# EAGLE design Artemis Charger Mod PCB.1 (EAGLE 7.5.0)
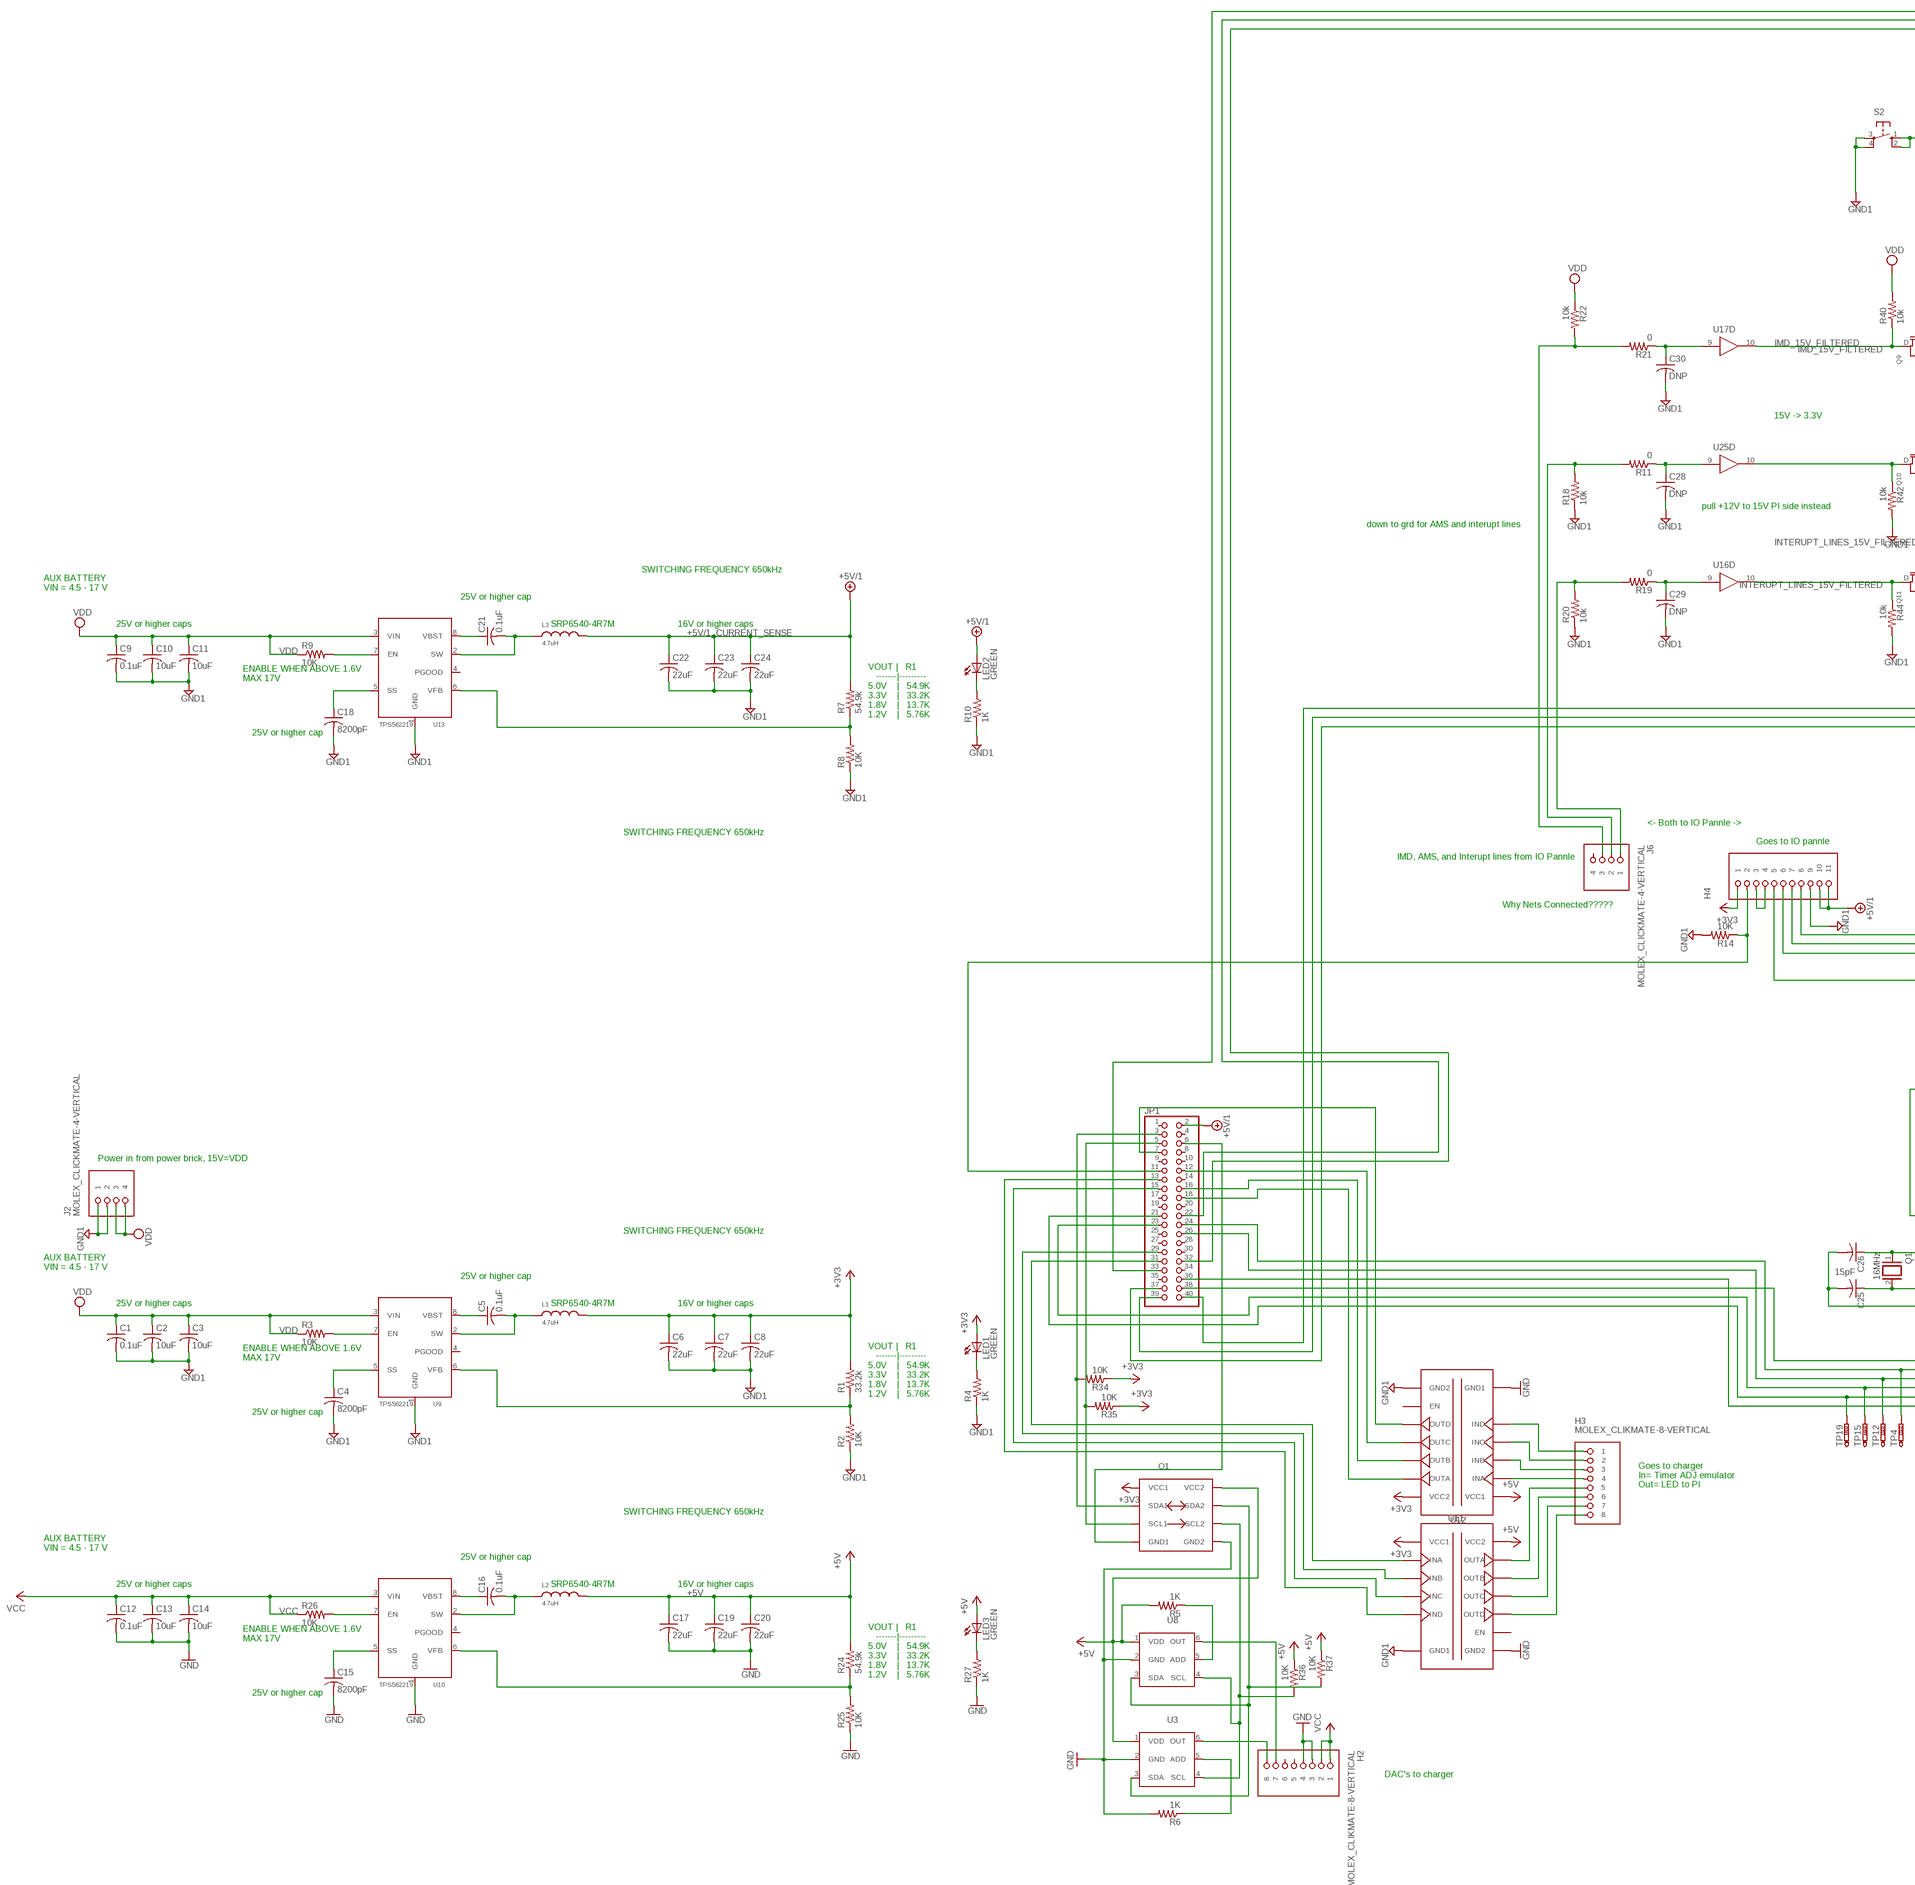
[diagram p0: schematic, sheet 1, part 1 of 2]
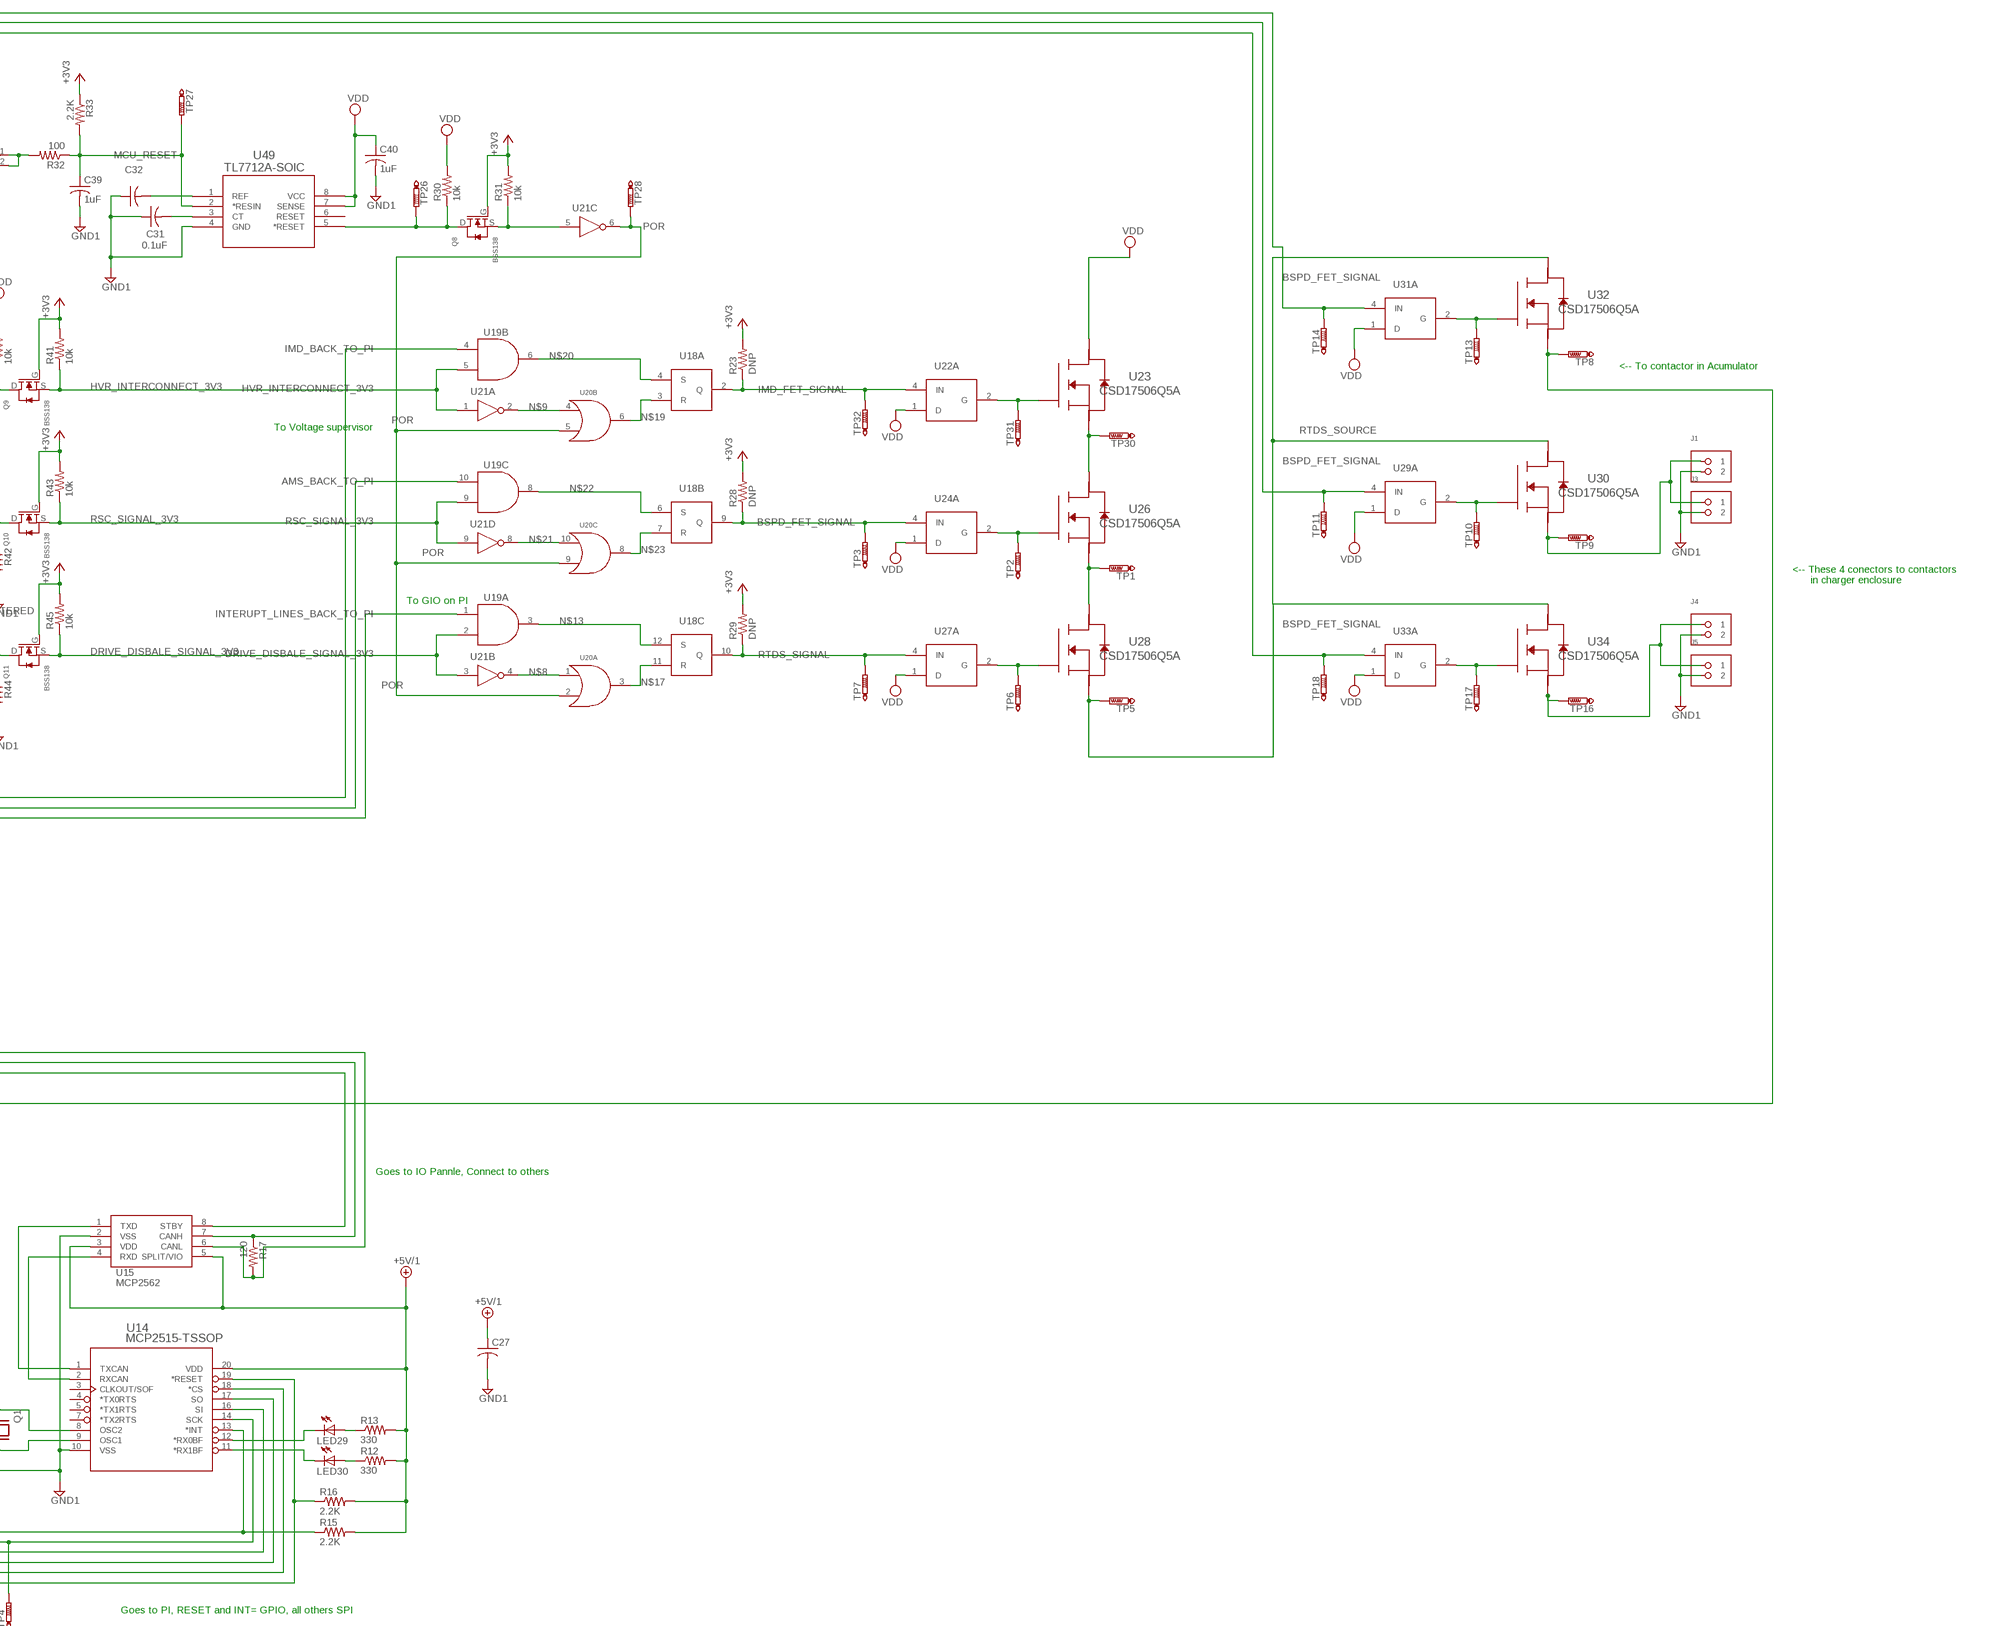
[diagram p1: schematic, sheet 1, part 2 of 2]

## Parts
C1  0.1uF  C-USC0805  [C0805]
C2  10uF  C-USC0805  [C0805]
C3  10uF  C-USC0805  [C0805]
C4  8200pF  C-USC0805  [C0805]
C5  0.1uF  C-USC0805  [C0805]
C6  22uF  C-USC0805  [C0805]
C7  22uF  C-USC0805  [C0805]
C8  22uF  C-USC0805  [C0805]
C9  0.1uF  C-USC0805  [C0805]
C10  10uF  C-USC0805  [C0805]
C11  10uF  C-USC0805  [C0805]
C12  0.1uF  C-USC0805  [C0805]
C13  10uF  C-USC0805  [C0805]
C14  10uF  C-USC0805  [C0805]
C15  8200pF  C-USC0805  [C0805]
C16  0.1uF  C-USC0805  [C0805]
C17  22uF  C-USC0805  [C0805]
C18  8200pF  C-USC0805  [C0805]
C19  22uF  C-USC0805  [C0805]
C20  22uF  C-USC0805  [C0805]
C21  0.1uF  C-USC0805  [C0805]
C22  22uF  C-USC0805  [C0805]
C23  22uF  C-USC0805  [C0805]
C24  22uF  C-USC0805  [C0805]
C25  15pF  C-USC0805  [C0805]
C26  15pF  C-USC0805  [C0805]
C27  0.1uF  C-USC0805  [C0805]
C28  DNP  C-USC0805  [C0805]
C29  DNP  C-USC0805  [C0805]
C30  DNP  C-USC0805  [C0805]
C31  0.1uF  C-USC0805  [C0805]
C32  0.1uF  C-USC0805  [C0805]
C39  1uF  C-USC0805  [C0805]
C40  1uF  C-USC0805  [C0805]
H2  MOLEX_CLIKMATE-8-VERTICAL  [MOLEX-CLIKMATE-8-VERTICAL-HEADER]
H3  MOLEX_CLIKMATE-8-VERTICAL  [MOLEX-CLIKMATE-8-VERTICAL-HEADER]
H4  MOLEX_CLICKMATE-11-VERTICAL-VERTICAL  [MOLEX_CLICKMATE-11-VERTICAL-HEADER]
J1  MOLEX_CLICKMATE-2-VERTICAL  [MOLEX-CLIKMATE-2-VERTICAL-HEADER]
J2  MOLEX_CLICKMATE-4-VERTICAL  [MOLEX-CLIKMATE-4-VERTICAL-HEADER]
J3  MOLEX_CLICKMATE-2-VERTICAL  [MOLEX-CLIKMATE-2-VERTICAL-HEADER]
J4  MOLEX_CLICKMATE-2-VERTICAL  [MOLEX-CLIKMATE-2-VERTICAL-HEADER]
J5  MOLEX_CLICKMATE-2-VERTICAL  [MOLEX-CLIKMATE-2-VERTICAL-HEADER]
J6  MOLEX_CLICKMATE-4-VERTICAL  [MOLEX-CLIKMATE-4-VERTICAL-HEADER]
JP1  PINHD-2X20  [2X20]
L1  4.7uH  SRP6540  [SRP6540]
L2  4.7uH  SRP6540  [SRP6540]
L3  4.7uH  SRP6540  [SRP6540]
LED1  GREEN  LEDCHIPLED_0805  [CHIPLED_0805]
LED2  GREEN  LEDCHIPLED_0805  [CHIPLED_0805]
LED3  GREEN  LEDCHIPLED_0805  [CHIPLED_0805]
LED29  LEDCHIP-LED0805  [CHIP-LED0805]
LED30  LEDCHIP-LED0805  [CHIP-LED0805]
O1  ISO1541  [ISO1541]
Q1  16MHz  XTAL/S  [QS]
Q8  BSS138  [BSS138]
Q9  BSS138  [BSS138]
Q10  BSS138  [BSS138]
Q11  BSS138  [BSS138]
R1  33.2k  R-US_R0805  [R0805]
R2  10K  R-US_R0805  [R0805]
R3  10K  R-US_R0805  [R0805]
R4  1K  R-US_R0805  [R0805]
R5  1K  R-US_R0805  [R0805]
R6  1K  R-US_R0805  [R0805]
R7  54.9k  R-US_R0805  [R0805]
R8  10K  R-US_R0805  [R0805]
R9  10K  R-US_R0805  [R0805]
R10  1K  R-US_R0805  [R0805]
R11  0  R-US_R0805  [R0805]
R12  330  R-US_R0805  [R0805]
R13  330  R-US_R0805  [R0805]
R14  10K  R-US_R0805  [R0805]
R15  2.2K  R-US_R0805  [R0805]
R16  2.2K  R-US_R0805  [R0805]
R17  120  R-US_R0805  [R0805]
R18  10k  R-US_R0805  [R0805]
R19  0  R-US_R0805  [R0805]
R20  10k  R-US_R0805  [R0805]
R21  0  R-US_R0805  [R0805]
R22  10k  R-US_R0805  [R0805]
R23  DNP  R-US_R0805  [R0805]
R24  54.9k  R-US_R0805  [R0805]
R25  10K  R-US_R0805  [R0805]
R26  10K  R-US_R0805  [R0805]
R27  1K  R-US_R0805  [R0805]
R28  DNP  R-US_R0805  [R0805]
R29  DNP  R-US_R0805  [R0805]
R30  10k  R-US_R0805  [R0805]
R31  10k  R-US_R0805  [R0805]
R32  100  R-US_R0805  [R0805]
R33  2.2K  R-US_R0805  [R0805]
R34  10K  R-US_R0805  [R0805]
R35  10K  R-US_R0805  [R0805]
R36  10K  R-US_R0805  [R0805]
R37  10K  R-US_R0805  [R0805]
R40  10k  R-US_R0805  [R0805]
R41  10k  R-US_R0805  [R0805]
R42  10k  R-US_R0805  [R0805]
R43  10k  R-US_R0805  [R0805]
R44  10k  R-US_R0805  [R0805]
R45  10k  R-US_R0805  [R0805]
S2  10-XX  [B3F-10XX]
TP1  PTR1TP20R  [TP20R]
TP2  PTR1TP20R  [TP20R]
TP3  PTR1TP20R  [TP20R]
TP4  PTR1TP20R  [TP20R]
TP5  PTR1TP20R  [TP20R]
TP6  PTR1TP20R  [TP20R]
TP7  PTR1TP20R  [TP20R]
TP8  PTR1TP20R  [TP20R]
TP9  PTR1TP20R  [TP20R]
TP10  PTR1TP20R  [TP20R]
TP11  PTR1TP20R  [TP20R]
TP12  PTR1TP20R  [TP20R]
TP13  PTR1TP20R  [TP20R]
TP14  PTR1TP20R  [TP20R]
TP15  PTR1TP20R  [TP20R]
TP16  PTR1TP20R  [TP20R]
TP17  PTR1TP20R  [TP20R]
TP18  PTR1TP20R  [TP20R]
TP19  PTR1TP20R  [TP20R]
TP26  PTR1TP20R  [TP20R]
TP27  PTR1TP20R  [TP20R]
TP28  PTR1TP20R  [TP20R]
TP30  PTR1TP20R  [TP20R]
TP31  PTR1TP20R  [TP20R]
TP32  PTR1TP20R  [TP20R]
U3  MAX5812  MAX5812M  [MAX5812]
U8  MAX5812  MAX5812M  [MAX5812]
U9  TPS562219  [TPS562219]
U10  TPS562219  [TPS562219]
U11  ISO7340  [ISO734X]
U12  ISO7340  [ISO734X]
U13  TPS562219  [TPS562219]
U14  MCP2515-TSSOP  [TSSOP20_MC]
U15  MCP2562  MCP256X-SOIC  [SOIC8-N_MC]
U16  CD4050BD  [SOIC-16]
U17  CD4050BD  [SOIC-16]
U18  CD4043B  [PW16-M]
U19  SN74LVC08ASOIC  [D14]
U20  SN74LVC32ASOIC  [D14]
U21  SN74LVC04ASOIC  [SOIC-14]
U22  LTC1155  [LT-SOL8]
U23  CSD17506Q5A  [SON_5X6]
U24  LTC1155  [LT-SOL8]
U25  CD4050BD  [SOIC-16]
U26  CSD17506Q5A  [SON_5X6]
U27  LTC1155  [LT-SOL8]
U28  CSD17506Q5A  [SON_5X6]
U29  LTC1155  [LT-SOL8]
U30  CSD17506Q5A  [SON_5X6]
U31  LTC1155  [LT-SOL8]
U32  CSD17506Q5A  [SON_5X6]
U33  LTC1155  [LT-SOL8]
U34  CSD17506Q5A  [SON_5X6]
U49  TL7712A-SOIC  TL7709A-SOIC  [D8]

## Nets
+3V3: H4.1 Q8.G Q9.G Q10.G Q11.G R23.2 R28.2 R29.2 R31.2 R33.1 R34.1 R35.1 R41.2 R43.2 R45.2
+3V3_CURRENT_SENSE: C6.1 C7.1 C8.1 L1.P$2 R1.2 ; supply symbol labelled +3V3
+5V: C17.1 C19.1 C20.1 L2.P$2 LED3.A O1.8(VCC2) R5.2 R24.2 R36.1 R37.1 U3.1(VDD) U8.1(VDD) U11.P$16(VCC2) U12.P$1(VCC1)
+5V/1_CURRENT_SENSE: C22.1 C23.1 C24.1 C27.1 H4.10 H4.11 JP1.2 L3.P$2 LED1.A LED2.A O1.1(VCC1) R7.2 R12.2 R13.2 R15.2 R16.2 U11.P$1(VCC1) U12.P$16(VCC2) U14.20(VDD) U15.3(VDD) U15.5(SPLIT/VIO) ; supply symbol labelled +3V3, +5V/1
AMS15V: J6.2 R11.2 R18.2
AMS_15V_FILTERED: Q10.D R42.1 U25.10(D:OUT)
AMS_BACK_TO_PI: JP1.39 U19.10(C:IN1)
BSPD_FET_SIGNAL: JP1.22 JP1.32 JP1.33 R28.1 TP3.TP TP11.TP TP14.TP TP18.TP U18.9(B:Q) U24.4(A:IN) U29.4(A:IN) U31.4(A:IN) U33.4(A:IN)
CAN_HIGH: H4.7 R17.1 U15.7(CANH)
DRIVE_DISBALE_SIGNAL_3V3: Q11.S R45.1 U19.2(A:IN2) U21.3(B:IN)
GND: C12.2 C13.2 C14.2 C15.2 C17.2 C19.2 C20.2 H2.3 H2.4 O1.5(GND2) R6.2 R25.1 R27.1 U3.2(GND) U8.2(GND) U10.1(GND) U11.P$9(GND2) U11.P$15(GND2) U12.P$2(GND1) U12.P$8(GND1)
GND1: C1.2 C2.2 C3.2 C4.2 C6.2 C7.2 C8.2 C9.2 C10.2 C11.2 C18.2 C22.2 C23.2 C24.2 C25.2 C26.2 C27.2 C28.2 C29.2 C30.2 C31.1 C32.1 C39.2 C40.2 H4.9 J1.2 J2.1 J2.2 J3.2 J4.2 J5.2 R2.1 R4.1 R8.1 R10.1 R14.2 R18.1 R20.1 R42.2 R44.2 S2.3(P) S2.4(P1) U9.1(GND) U11.P$2(GND1) U11.P$8(GND1) U12.P$9(GND2) U12.P$15(GND2) U13.1(GND) U14.10(VSS) U15.2(VSS) U49.4(GND)
HVR_INTERCONNECT_3V3: Q9.S R41.1 U19.5(B:IN2) U21.1(A:IN)
IMD15V: J6.3 R21.2 R22.2
IMD_15V_FILTERED: Q9.D R40.1 U17.10(D:OUT)
IMD_BACK_TO_PI: JP1.40 U19.4(B:IN1)
IMD_FET_SIGNAL: R23.1 TP32.TP U18.2(A:Q) U22.4(A:IN)
INTERUPT15V: J6.1 R19.2 R20.2
INTERUPT_LINES_15V_FILTERED: Q11.D R44.1 U16.10(D:OUT)
INTERUPT_LINES_BACK_TO_PI: JP1.37 U19.1(A:IN1)
MCU_RESET: C39.1 R32.1 R33.2 TP27.TP U49.2(*RESIN)
MI: JP1.26 TP12.TP U14.16(SI)
MO: JP1.23 TP15.TP U14.17(SO)
N$1: R3.2 U9.7(EN)
N$2: LED1.C R4.2
N$4: R5.1 U8.5(ADD)
N$5: JP1.31 U11.P$3(INA)
N$6: J4.1 J5.1 TP16.TP U34.1(S) U34.2(S) U34.3(S)
N$7: O1.7(SDA2) U3.3(SDA) U8.3(SDA)
N$8: O1.6(SCL2) R36.2 U3.4(SCL) U8.4(SCL) U20.1(A:IN1) U21.4(B:OUT)
N$9: JP1.3 O1.2(SDA1) R34.2 U20.4(B:IN1) U21.2(A:OUT)
N$10: JP1.5 O1.3(SCL1) R35.2
N$11: R6.1 U3.5(ADD)
N$13: U18.12(C:S) U19.3(A:OUT)
N$17: U18.11(C:R) U20.3(A:OUT)
N$18: JP1.6 O1.4(GND1)
N$19: U18.3(A:R) U20.6(B:OUT)
N$20: U18.4(A:S) U19.6(B:OUT)
N$21: U20.10(C:IN1) U21.8(D:OUT)
N$22: U18.6(B:S) U19.8(C:OUT)
N$23: R26.2 U10.7(EN) U18.7(B:R) U20.8(C:OUT)
N$24: JP1.29 U11.P$4(INB)
N$25: H2.8 U3.6(OUT)
N$26: H2.7 U8.6(OUT)
N$27: JP1.13 U11.P$6(IND)
N$28: LED3.C R27.2
N$29: JP1.15 U11.P$5(INC)
N$30: H3.5 U11.P$14(OUTA)
N$31: H3.6 U11.P$13(OUTB)
N$32: H3.7 U11.P$12(OUTC)
N$33: H3.8 U11.P$11(OUTD)
N$34: H3.4 U12.P$3(INA)
N$35: H3.3 U12.P$4(INB)
N$36: H3.2 U12.P$5(INC)
N$37: H3.1 U12.P$6(IND)
N$38: JP1.18 U12.P$14(OUTA)
N$39: JP1.16 U12.P$13(OUTB)
N$40: JP1.12 U12.P$12(OUTC)
N$41: JP1.7 U12.P$11(OUTD)
N$42: H4.3 H4.4
N$43: C28.1 R11.1 U25.9(D:IN)
N$44: R9.2 U13.7(EN)
N$45: LED2.C R10.2
N$46: U14.2(RXCAN) U15.4(RXD)
N$47: U14.1(TXCAN) U15.1(TXD)
N$48: H4.6 U15.8(STBY)
N$49: JP1.38 R15.1 U14.13(*INT)
N$50: C29.1 R19.1 U16.9(D:IN)
N$51: H4.8 R17.2 U15.6(CANL)
N$52: H4.2 JP1.11 R14.1
N$53: C30.1 R21.1 U17.9(D:IN)
N$54: TP31.TP U22.2(A:G) U23.4(G)
N$55: TP2.TP U24.2(A:G) U26.4(G)
N$56: TP6.TP U27.2(A:G) U28.4(G)
N$57: TP10.TP U29.2(A:G) U30.4(G)
N$58: Q8.S R31.1 U21.5(C:IN)
N$59: TP13.TP U31.2(A:G) U32.4(G)
N$61: Q8.D R30.1 TP26.TP U49.5(*RESET)
N$62: R32.2 S2.1(S) S2.2(S1)
N$64: TP17.TP U33.2(A:G) U34.4(G)
N$68: JP1.36 R16.1 U14.19(*RESET)
N$70: JP1.21 TP19.TP U14.18(*CS)
N$77: LED30.C U14.11(*RX1BF)
N$80: LED29.C U14.12(*RX0BF)
N$99: LED30.A R12.1
N$100: LED29.A R13.1
N$123: C26.1 Q1.1 U14.8(OSC2)
N$124: C25.1 Q1.2 U14.9(OSC1)
N$189: C31.2 U49.3(CT)
N$190: C32.2 U49.1(REF)
POR: TP28.TP U20.2(A:IN2) U20.5(B:IN2) U20.9(C:IN2) U21.6(C:OUT)
RSC_SIGNAL_3V3: Q10.S R43.1 U19.9(C:IN2) U21.9(D:IN)
RTDS_SIGNAL: R29.1 TP7.TP U18.10(C:Q) U27.4(A:IN)
RTDS_SOURCE: TP1.TP TP5.TP TP30.TP U23.1(S) U23.2(S) U23.3(S) U26.1(S) U26.2(S) U26.3(S) U26.5(D) U26.6(D) U26.7(D) U26.8(D) U26.PAD1(D) U26.PAD(D) U26.VIA1(D) U26.VIA2(D) U26.VIA3(D) U26.VIA4(D) U26.VIA5(D) U26.VIA6(D) U26.VIA7(D) U26.VIA8(D) U26.VIA9(D) U28.1(S) U28.2(S) U28.3(S) U28.5(D) U28.6(D) U28.7(D) U28.8(D) U28.PAD1(D) U28.PAD(D) U28.VIA1(D) U28.VIA2(D) U28.VIA3(D) U28.VIA4(D) U28.VIA5(D) U28.VIA6(D) U28.VIA7(D) U28.VIA8(D) U28.VIA9(D) U30.5(D) U30.6(D) U30.7(D) U30.8(D) U30.PAD1(D) U30.PAD(D) U30.VIA1(D) U30.VIA2(D) U30.VIA3(D) U30.VIA4(D) U30.VIA5(D) U30.VIA6(D) U30.VIA7(D) U30.VIA8(D) U30.VIA9(D) U32.5(D) U32.6(D) U32.7(D) U32.8(D) U32.PAD1(D) U32.PAD(D) U32.VIA1(D) U32.VIA2(D) U32.VIA3(D) U32.VIA4(D) U32.VIA5(D) U32.VIA6(D) U32.VIA7(D) U32.VIA8(D) U32.VIA9(D) U34.5(D) U34.6(D) U34.7(D) U34.8(D) U34.PAD1(D) U34.PAD(D) U34.VIA1(D) U34.VIA2(D) U34.VIA3(D) U34.VIA4(D) U34.VIA5(D) U34.VIA6(D) U34.VIA7(D) U34.VIA8(D) U34.VIA9(D)
RTDS_SOURCE1: J1.1 J3.1 TP9.TP U30.1(S) U30.2(S) U30.3(S)
RTDS_SOURCE2: H4.5 TP8.TP U32.1(S) U32.2(S) U32.3(S)
SCK: JP1.24 TP4.TP U14.14(SCK)
SS_5V: C15.1 U10.5(SS)
SS_5V1: C4.1 U9.5(SS)
SS_5V2: C18.1 U13.5(SS)
SW_5V: C16.2 C21.1 C21.2 L2.P$1 L3.P$1 U10.2(SW) U13.2(SW) U13.8(VBST)
SW_5V1: C5.2 L1.P$1 U9.2(SW)
VBST_5V: C16.1 U10.8(VBST)
VBST_5V1: C5.1 U9.8(VBST)
VCC: C12.1 C13.1 C14.1 H2.1 H2.2 R26.1 U10.3(VIN)
VDD: C1.1 C2.1 C3.1 C9.1 C10.1 C11.1 C40.1 J2.3 J2.4 R3.1 R9.1 R22.1 R30.2 R40.2 U9.3(VIN) U13.3(VIN) U22.1(A:D) U23.5(D) U23.6(D) U23.7(D) U23.8(D) U23.PAD1(D) U23.PAD(D) U23.VIA1(D) U23.VIA2(D) U23.VIA3(D) U23.VIA4(D) U23.VIA5(D) U23.VIA6(D) U23.VIA7(D) U23.VIA8(D) U23.VIA9(D) U24.1(A:D) U27.1(A:D) U29.1(A:D) U31.1(A:D) U33.1(A:D) U49.7(SENSE) U49.8(VCC)
VFB_5V: R24.1 R25.2 U10.6(VFB)
VFB_5V1: R1.1 R2.2 U9.6(VFB)
VFB_5V2: R7.1 R8.2 U13.6(VFB)
Unconnected: H2.5 H2.6 J6.4 JP1.1 JP1.4 JP1.8 JP1.9 JP1.10 JP1.14 JP1.17 JP1.19 JP1.20 JP1.25 JP1.27 JP1.28 JP1.30 JP1.34 JP1.35 R37.2 U9.4(PGOOD) U10.4(PGOOD) U11.P$10(EN) U12.P$10(EN) U13.4(PGOOD) U14.3(CLKOUT/SOF) U14.4(*TX0RTS) U14.5(*TX1RTS) U14.7(*TX2RTS) U16.2(A:OUT) U16.3(A:IN) U16.4(B:OUT) U16.5(B:IN) U16.6(C:OUT) U16.7(C:IN) U16.11(E:IN) U16.12(E:OUT) U16.14(F:IN) U16.15(F:OUT) U17.2(A:OUT) U17.3(A:IN) U17.4(B:OUT) U17.5(B:IN) U17.6(C:OUT) U17.7(C:IN) U17.11(E:IN) U17.12(E:OUT) U17.14(F:IN) U17.15(F:OUT) U18.1(D:Q) U18.5(EN:EN) U18.14(D:S) U18.15(D:R) U19.11(D:OUT) U19.12(D:IN2) U19.13(D:IN1) U20.11(D:OUT) U20.12(D:IN2) U20.13(D:IN1) U21.10(E:OUT) U21.11(E:IN) U21.12(F:OUT) U21.13(F:IN) U22.5(B:IN) U22.7(B:G) U22.8(B:D) U24.5(B:IN) U24.7(B:G) U24.8(B:D) U25.2(A:OUT) U25.3(A:IN) U25.4(B:OUT) U25.5(B:IN) U25.6(C:OUT) U25.7(C:IN) U25.11(E:IN) U25.12(E:OUT) U25.14(F:IN) U25.15(F:OUT) U27.5(B:IN) U27.7(B:G) U27.8(B:D) U29.5(B:IN) U29.7(B:G) U29.8(B:D) U31.5(B:IN) U31.7(B:G) U31.8(B:D) U33.5(B:IN) U33.7(B:G) U33.8(B:D) U49.6(RESET)

## Notes on the sheet
- <-- To contactor in Acumulator
- To Voltage supervisor
- 15V -> 3.3V
- pull +12V to 15V PI side instead
- <-- These 4 conectors to contactors
        in charger enclosure
- down to grd for AMS and interupt lines
- To GIO on PI
- SWITCHING FREQUENCY 650kHz
- AUX BATTERY
  VIN = 4.5 - 17 V
- 25V or higher cap
- 25V or higher caps | SRP6540-4R7M | 16V or higher caps
- ENABLE WHEN ABOVE 1.6V
  MAX 17V
- VOUT |   R1
     -------|---------
  5.0V    |   54.9K
  3.3V    |   33.2K
  1.8V    |   13.7K
  1.2V    |   5.76K
- 25V or higher cap
- SWITCHING FREQUENCY 650kHz | <- Both to IO Pannle ->
- Goes to IO pannle
- IMD, AMS, and Interupt lines from IO Pannle
- Why Nets Connected?????
- Goes to IO Pannle, Connect to others
- Power in from power brick, 15V=VDD
- SWITCHING FREQUENCY 650kHz
- AUX BATTERY
  VIN = 4.5 - 17 V
- 25V or higher cap
- 25V or higher caps | SRP6540-4R7M | 16V or higher caps
- ENABLE WHEN ABOVE 1.6V
  MAX 17V
- VOUT |   R1
     -------|---------
  5.0V    |   54.9K
  3.3V    |   33.2K
  1.8V    |   13.7K
  1.2V    |   5.76K
- 25V or higher cap
- Goes to PI, RESET and INT= GPIO, all others SPI
- Goes to charger
  In= Timer ADJ emulator
- Out= LED to PI
- SWITCHING FREQUENCY 650kHz
- AUX BATTERY
  VIN = 4.5 - 17 V
- 25V or higher cap
- 25V or higher caps | SRP6540-4R7M | 16V or higher caps
- ENABLE WHEN ABOVE 1.6V
  MAX 17V
- VOUT |   R1
     -------|---------
  5.0V    |   54.9K
  3.3V    |   33.2K
  1.8V    |   13.7K
  1.2V    |   5.76K
- 25V or higher cap
- DAC's to charger

## Power pins joined to a net without a drawn wire
GND: U16.8(POWER:GND) U17.8(POWER:GND) U18.8(P:GND) U19.7(P:GND) U20.7(P:GND) U21.7(POWER:GND) U22.3(P:GND) U24.3(P:GND) U25.8(POWER:GND) U27.3(P:GND) U29.3(P:GND) U31.3(P:GND) U33.3(P:GND)
VCC: U16.1(POWER:VCC) U17.1(POWER:VCC) U18.16(P:VCC) U19.14(P:VCC) U20.14(P:VCC) U21.14(POWER:VCC) U22.6(P:VCC) U24.6(P:VCC) U25.1(POWER:VCC) U27.6(P:VCC) U29.6(P:VCC) U31.6(P:VCC) U33.6(P:VCC)

## Library data of the parts
C1 C5 C9 C12 C16 C21 = adafruit:C-US: CAPACITOR, American symbol; PARTNO: GRM21BR71E104KA01L
C2 C3 C10 C11 C13 C14 = adafruit:C-US: CAPACITOR, American symbol; PARTNO: GRM21BR61E106KA73L
C4 C15 C18 = adafruit:C-US: CAPACITOR, American symbol; PARTNO: C0805C822K5RACTU
C6-C8 C17 C19 C20 C22-C24 = adafruit:C-US: CAPACITOR, American symbol; PARTNO: C2012JB1E226M125AC
C25 C26 = rcl:C-US: CAPACITOR, American symbol; MPN: 08051A150JAT2A; OC_NEWARK: 96M1322; PARTNO: CL21C150JBANNNC
C27 = rcl:C-US: CAPACITOR, American symbol; MPN: C1005X7R1E104K050BB; OC_NEWARK: 04X3227; PARTNO: GRM21BR71E104KA01L
C28-C30 = rcl:C-US: CAPACITOR, American symbol
C31 C32 = adafruit:C-US: CAPACITOR, American symbol; MPN: C2012X7R1H104K085AA; OC_NEWARK: 04X3288; PARTNO: GRM21BR71E104KA01L
C39 C40 = rcl:C-US: CAPACITOR, American symbol; PARTNO: EMK212B7105KG-T
H2 H3 = FormE:MOLEX_CLIKMATE-8-VERTICAL: 505405-0860
H4 = FormE:MOLEX_CLICKMATE-11-VERTICAL
J1 J3-J5 = FormE:MOLEX_CLICKMATE-2-VERTICAL: 5025840270
J2 J6 = FormE:MOLEX_CLICKMATE-4-VERTICAL: 5025840470
JP1 = pinhead:PINHD-2X20: PIN HEADER
L1-L3 = FormE:SRP6540; PARTNO: SRP6540-4R7M
LED1-LED3 = FormE:LED: LED OSRAM: - CHIPLED LG R971, LG N971, LY N971, LG Q971, LY Q971, LO R971, LY R971 LH N974, LH R974 LS Q976, LO Q976, LY Q976 LO Q996 - Hyper CHIPLED LW Q18S LB Q993, LB Q99A, LB R99A - SideLED LS A670, LO A670, LY A670, LG A670, LP A670 LB A673, LV A673, LT A673, LW A673 LH A674 LY A675 LS A676, LA A676, LO A676, LY A676, LW A676 LS A679, LY A679, LG A679 - Hyper Micro SIDELED® LS Y876, LA Y876, LO Y876, LY Y876 LT Y87S - SmartLED LW L88C, LW L88S LB L89C, LB L89S, LG L890 LS L89K, LO L89K, LY L89K LS L896, LA L896, LO L896, LY L896 - TOPLED LS T670, LO T670, LY T670, LG T670, LP T670 LSG T670, LSP T670, LSY T670, LOP T670, LYG T670 LG T671, LOG T671, LSG T671 LB T673, LV T673, LT T673, LW T673 LH T674 LS T676, LA T676, LO T676, LY T676, LB T676, LH T676, LSB T676, LW T676 LB T67C, LV T67C, LT T67C, LS T67K, LO T67K, LY T67K, LW E67C LS E67B, LA E67B, LO E67B, LY E67B, LB E67C, LV E67C, LT E67C LW T67C LS T679, LY T679, LG T679 LS T770, LO T770, LY T770, LG T770, LP T770 LB T773, LV T773, LT T773, LW T773 LH T774 LS E675, LA E675, LY E675, LS T675 LS T776, LA T776, LO T776, LY T776, LB T776 LHGB T686 LT T68C, LB T68C - Hyper Mini TOPLED® LB M676 - Mini TOPLED Santana® LG M470 LS M47K, LO M47K, LY M47K Source: http://www.osram.convergy.de/; PARTNO: 598-8170-107F
LED29 LED30 = adafruit:LED: LED OSRAM: - CHIPLED LG R971, LG N971, LY N971, LG Q971, LY Q971, LO R971, LY R971 LH N974, LH R974 LS Q976, LO Q976, LY Q976 LO Q996 - Hyper CHIPLED LW Q18S LB Q993, LB Q99A, LB R99A - SideLED LS A670, LO A670, LY A670, LG A670, LP A670 LB A673, LV A673, LT A673, LW A673 LH A674 LY A675 LS A676, LA A676, LO A676, LY A676, LW A676 LS A679, LY A679, LG A679 - Hyper Micro SIDELED® LS Y876, LA Y876, LO Y876, LY Y876 LT Y87S - SmartLED LW L88C, LW L88S LB L89C, LB L89S, LG L890 LS L89K, LO L89K, LY L89K LS L896, LA L896, LO L896, LY L896 - TOPLED LS T670, LO T670, LY T670, LG T670, LP T670 LSG T670, LSP T670, LSY T670, LOP T670, LYG T670 LG T671, LOG T671, LSG T671 LB T673, LV T673, LT T673, LW T673 LH T674 LS T676, LA T676, LO T676, LY T676, LB T676, LH T676, LSB T676, LW T676 LB T67C, LV T67C, LT T67C, LS T67K, LO T67K, LY T67K, LW E67C LS E67B, LA E67B, LO E67B, LY E67B, LB E67C, LV E67C, LT E67C LW T67C LS T679, LY T679, LG T679 LS T770, LO T770, LY T770, LG T770, LP T770 LB T773, LV T773, LT T773, LW T773 LH T774 LS E675, LA E675, LY E675, LS T675 LS T776, LA T776, LO T776, LY T776, LB T776 LHGB T686 LT T68C, LB T68C - Hyper Mini TOPLED® LB M676 - Mini TOPLED Santana® LG M470 LS M47K, LO M47K, LY M47K Source: http://www.osram.convergy.de/; OC_NEWARK: unknown; PARTNO: 598-8170-107F
O1 = FormE:ISO1541
Q1 = special:XTAL/S: CRYSTAL; MF: RALTRON; MPN: AS-16.000-18; OC_NEWARK: 96F2831; PARTNO: ATS16B
Q8-Q11 = FormE:BSS138; PARTNO: BSS138
R1 R7 R24 = adafruit:R-US_: RESISTOR, American symbol; PARTNO: ERA-6AEB5492V
R2 R3 R8 R9 R14 R25 R26 R34-R37 = adafruit:R-US_: RESISTOR, American symbol; PARTNO: ERJ-6ENF1002V
R4-R6 R10 R27 = adafruit:R-US_: RESISTOR, American symbol; PARTNO: ERJ-6ENF1001V
R11 R19 R21 = rcl:R-US_: RESISTOR, American symbol; PARTNO: ERJ-6GEY0R00V
R12 R13 = adafruit:R-US_: RESISTOR, American symbol; OC_NEWARK: unknown; PARTNO: ERJ-P6WF3300V
R15 R16 = adafruit:R-US_: RESISTOR, American symbol; OC_NEWARK: unknown; PARTNO: ERA-6AEB222V
R17 = adafruit:R-US_: RESISTOR, American symbol; OC_NEWARK: unknown; PARTNO: ERJ-6ENF1200V
R18 R20 R22 R30 R31 R40-R45 = rcl:R-US_: RESISTOR, American symbol; PARTNO: ERJ-6ENF1002V
R23 R28 R29 = rcl:R-US_: RESISTOR, American symbol
R32 = rcl:R-US_: RESISTOR, American symbol; PARTNO: ERJ-6ENF1000V
R33 = rcl:R-US_: RESISTOR, American symbol; PARTNO: ERA-6AEB222V
S2 = switch-omron:10-XX: OMRON SWITCH; MPN: B3F-1000; OC_FARNELL: 176432; OC_NEWARK: 36M3542; PARTNO: B3F-1005
TP1-TP19 TP26-TP28 TP30-TP32 = testpad:PTR1: TEST PIN
U3 U8 = FormE:MAX5812
U9 U10 U13 = FormE:TPS562219; PARTNO: TPS562219DDFT
U11 U12 = FormE:ISO7340
U14 = FormE:MCP2515: MCP2515 CAN Interface via SPI; MPN: MCP2515-E/ST; OC_NEWARK: 11N7996; PARTNO: MCP2515-E/ST
U15 = FormE:MCP256X: MCP2561/2 CAN Transceiver Microchip High-Speed CAN Transceiver Datasheet <http://ww1.microchip.com/downloads/en/DeviceDoc/20005167C.pdf>; MPN: MCP2562-E/SN; OC_NEWARK: 85W9074; PARTNO: MCP2562-E/SN
U16 U17 U25 = FormE:CD4050B; PARTNO: CD4050BDR
U18 = FormE:CD4043B; PARTNO: CD4043BPWR
U19 = FormE:SN74LVC08A: LVC - Quad 2-Input AND; PARTNO: SN74LVC08ADR
U20 = FormE:SN74LVC32A: LVC - Quad 2-Input OR; PARTNO: SN74LVC32ADR
U21 = FormE:SN74LVC04A: LVC - Hex Inverter; PARTNO: SN74LVC04ADR
U22 U24 U27 U29 U31 U33 = FormE:LTC1155; PARTNO: LTC1155CS8#PBF
U23 U26 U28 U30 U32 U34 = FormE:CSD17506Q5A; PARTNO: CSD17506Q5A
U49 = FormE:TL7709A; DATASHEETURL: http://www.ti.com/lit/gpn/TL7709A; DESCRIPTION: Single Supply Voltage Supervisor ror 5V Systems with Programmable Time Delay; FAMILY_NAME: SUPERVISOR AND RESET IC; GENERIC_PART_NUMBER: TL7709A; INDUSTRY_STD_PKG_TYPE: SOIC; MANUFACTURER: Texas Instruments; MANUFACTURER_PART_NUMBER: tl7705b_d_8; MPN: TL7705BID; OC_NEWARK: 96W3363; PACKAGE_DESIGNATOR: D; PARTNO: TL7712ACDR; PIN_COUNT: 8; VENDOR: Texas Instruments

## Board
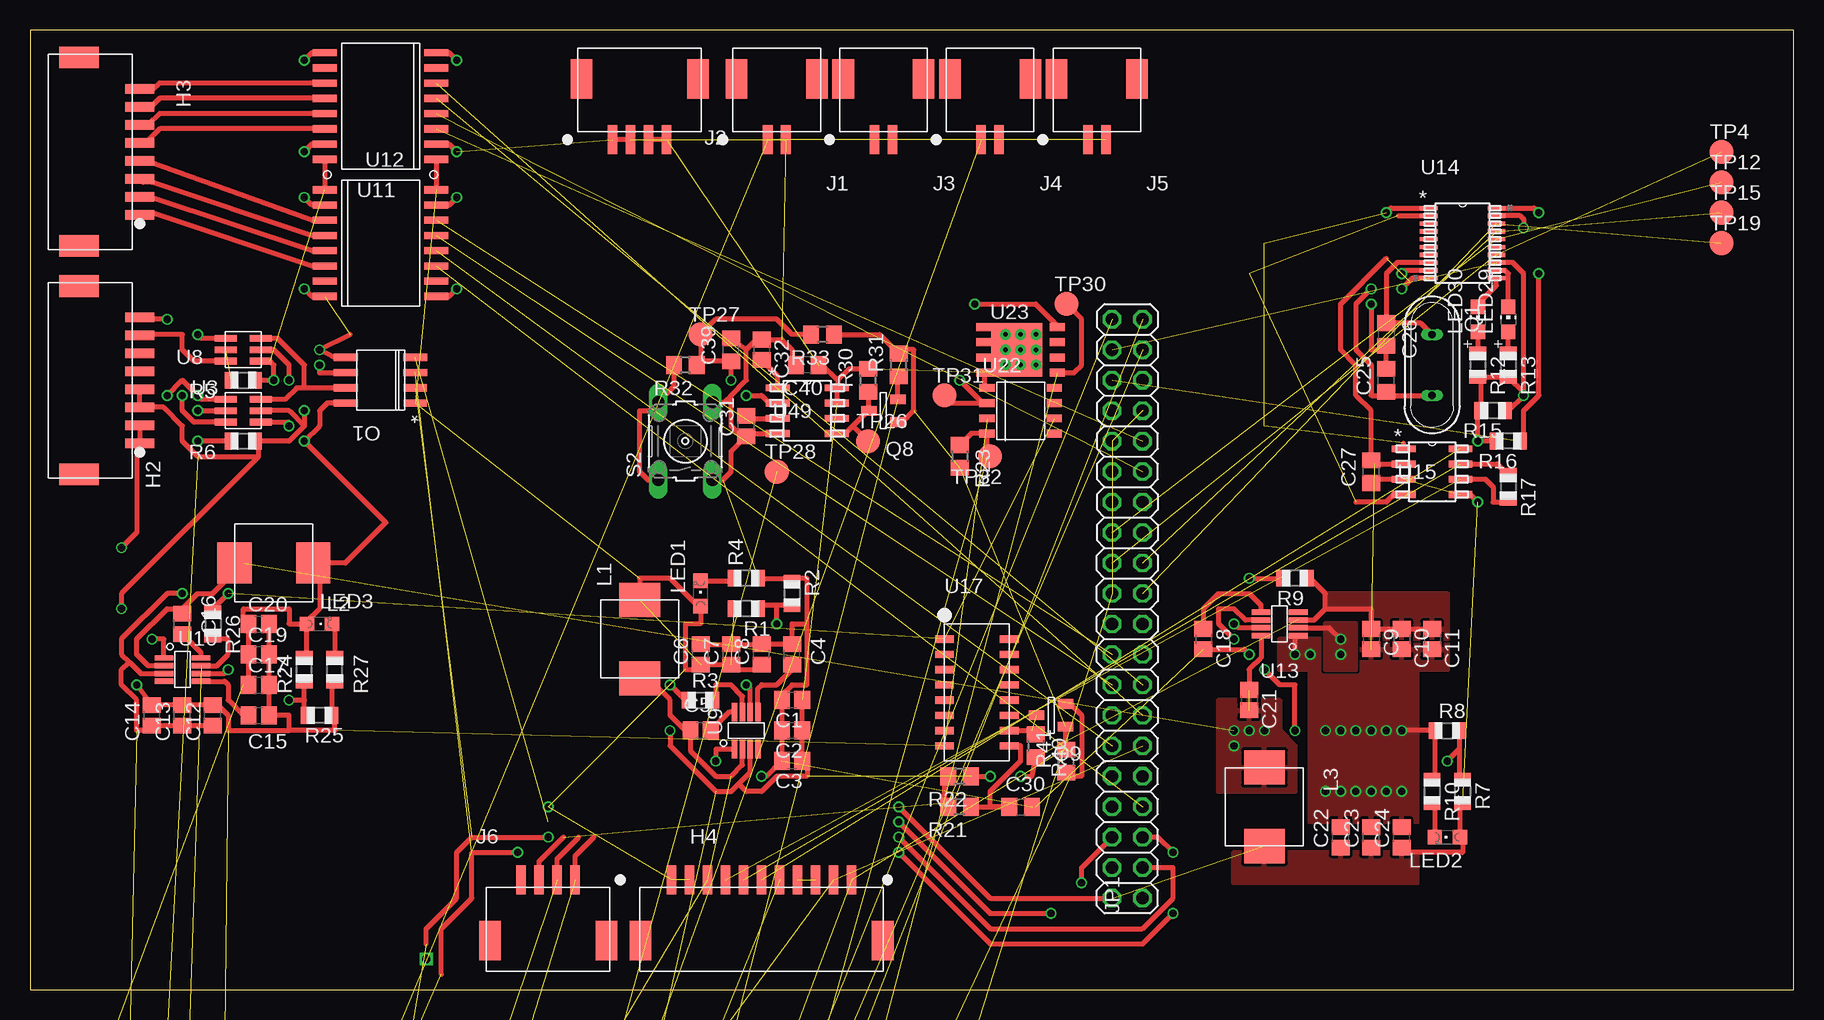
[diagram p2: board, top side]
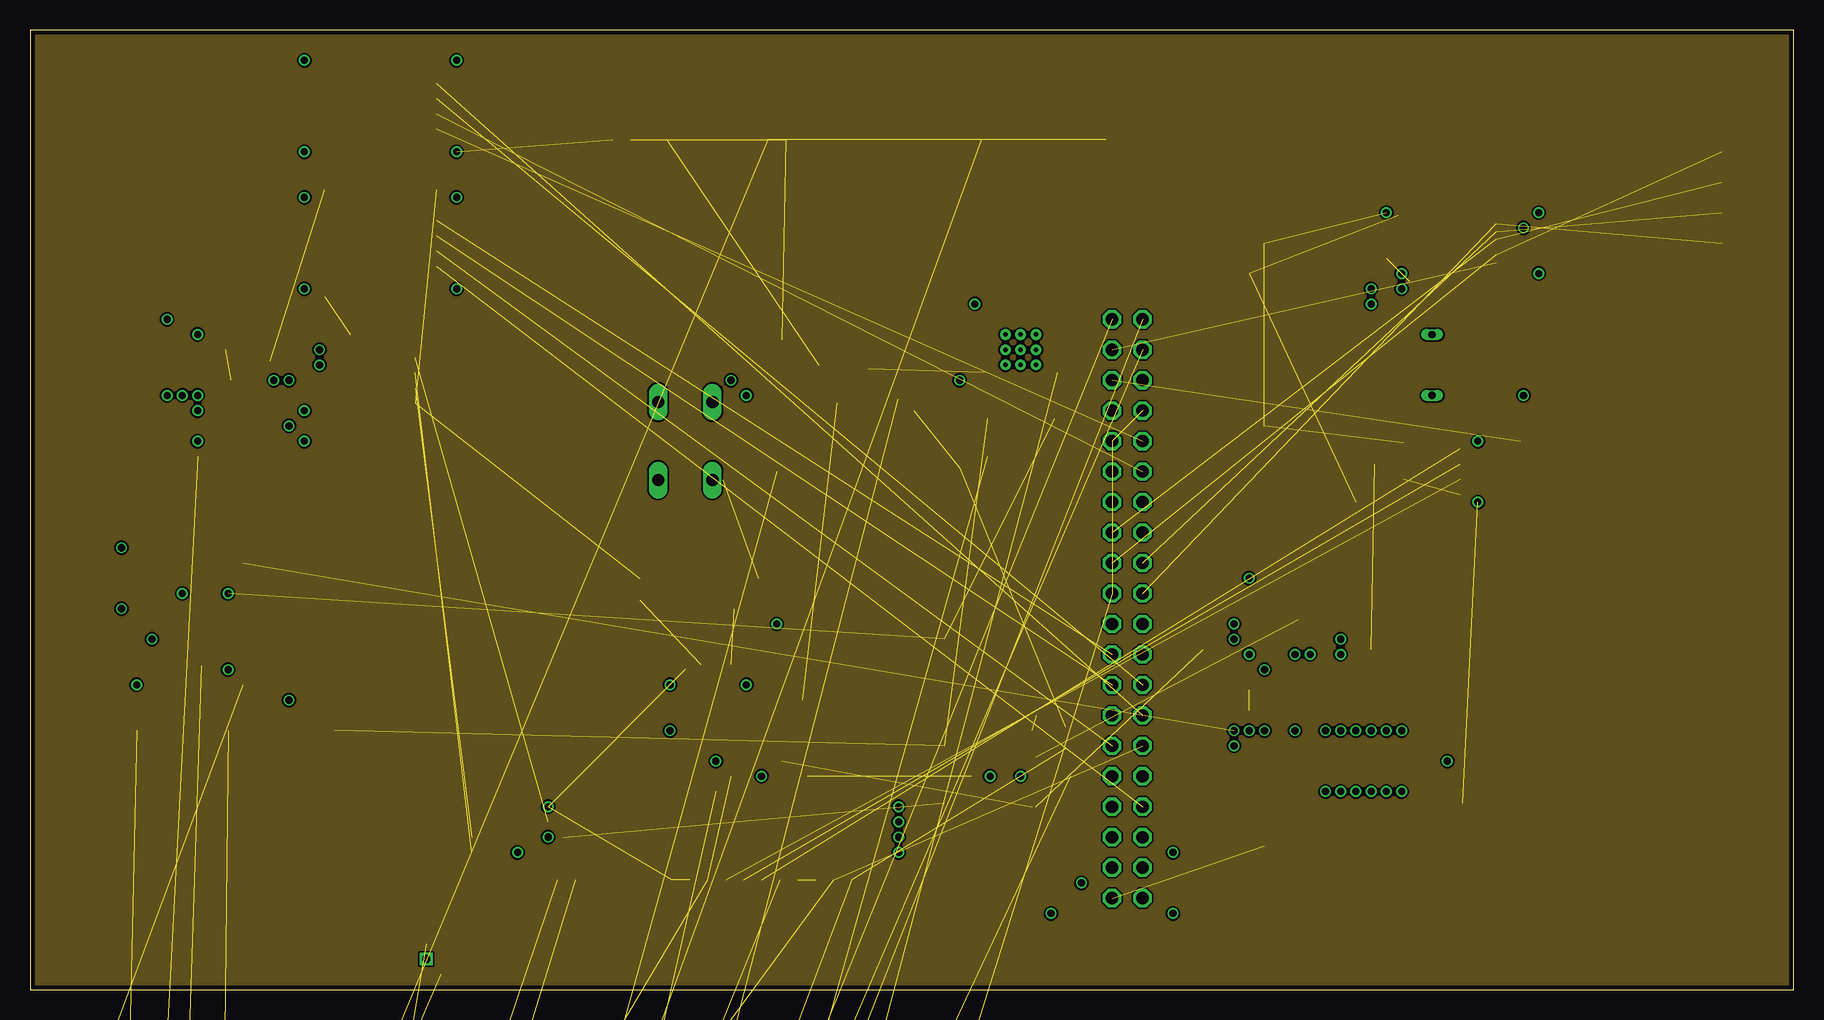
[diagram p3: board, inner layer Route2]
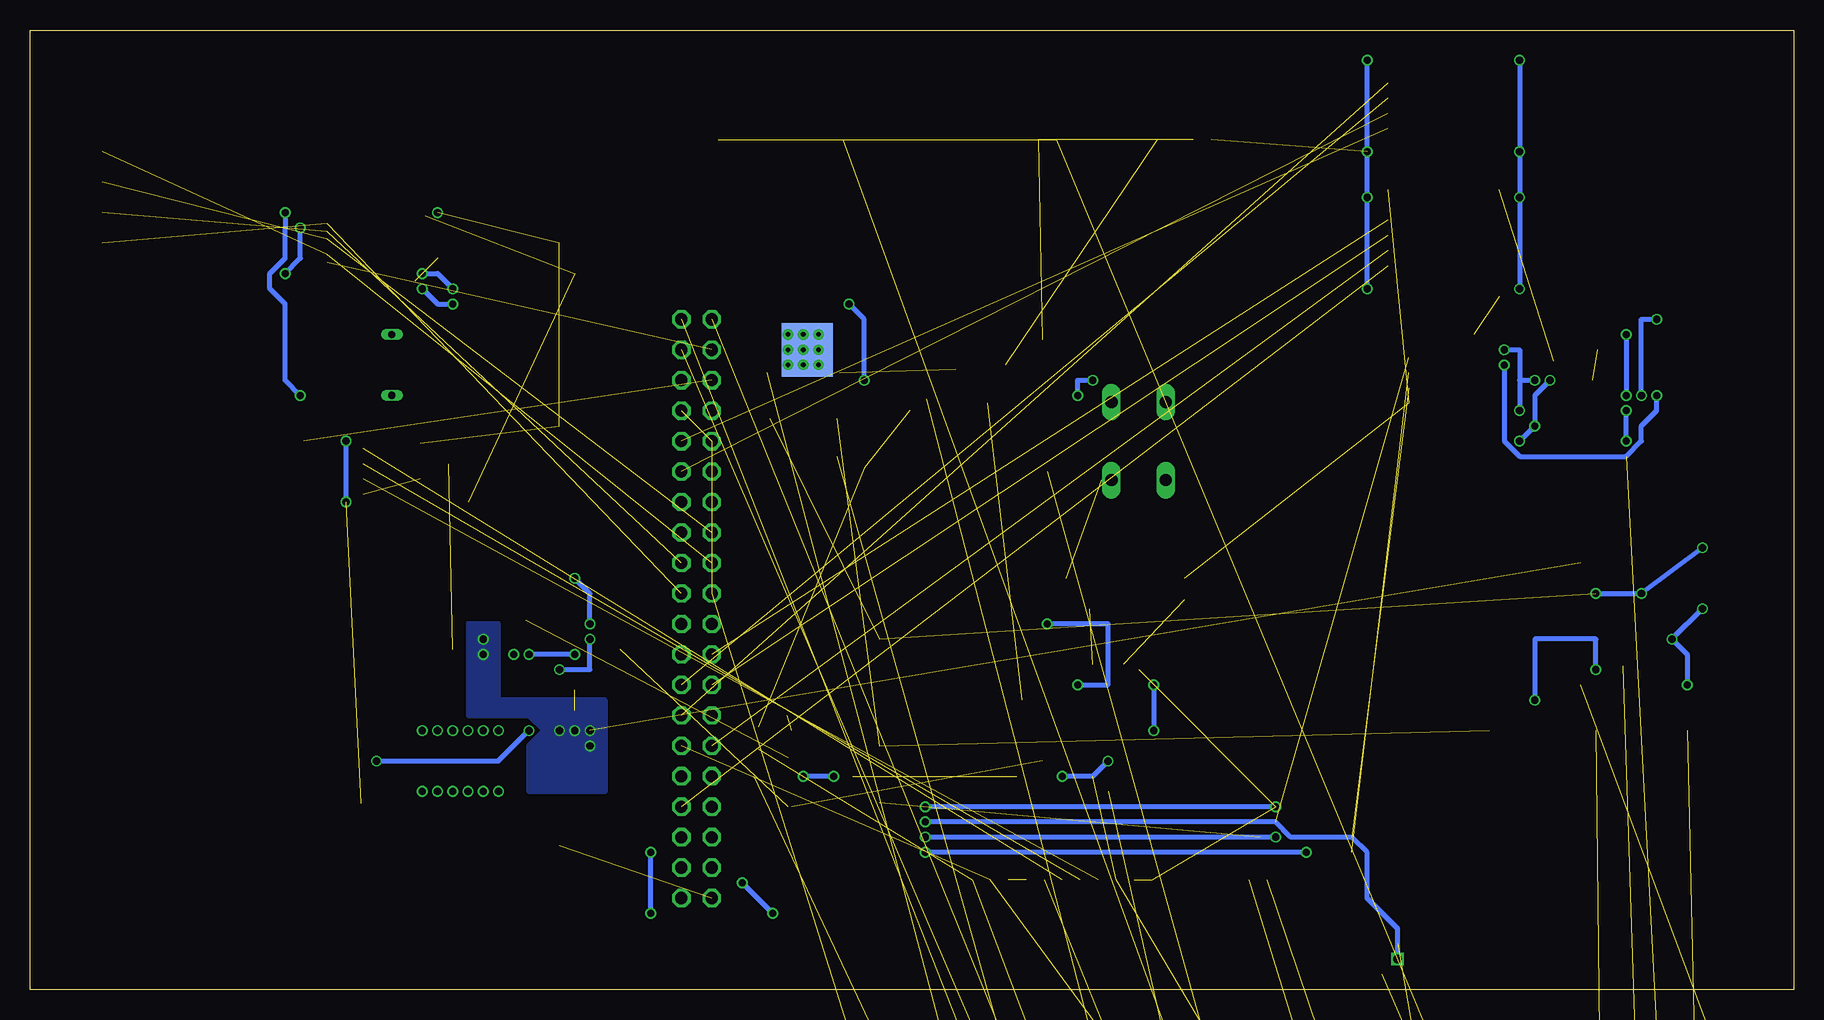
[diagram p4: board, bottom side, seen from below]

Size 146.99 x 80 mm. Coordinates in mm from the lower left corner, seen from the top.
Outline: 0,0 146.99,0 146.99,80 0,80 0,0
Copper layers (1*2*15*16): Top 0.035559375mm / dielectric 0.17018125mm / Route2 0.01778125mm / dielectric 47mil / Route15 0.01778125mm / dielectric 0.17018125mm / Bottom 0.035559375mm
Design rules "SierraCircuits-4layer": minimum track width 5mil, minimum drill 10mil, track to track 6mil, track to pad 6mil, pad to pad 6mil, via to via 6mil, smd to smd 6mil, copper to edge 15mil, drill to drill 6mil, minimum pad ring 5mil, minimum via ring 5mil, stop-mask expansion 4mil, vias tented up to drill 0mil, thermal gap 10mil

### Footprints (pad centres in the part's own frame; a part is rotated, then mirrored left to right if it is on the bottom)
C0805 = smd 1.3 x 1.5: 1 -0.85,0; 2 0.85,0
C0805' = smd 1.3 x 1.5: 1 -0.95,0; 2 0.95,0
MOLEX-CLIKMATE-8-VERTICAL-HEADER = smd 0.8 x 2.4: 1 5.25,4.064; 2 3.75,4.064; 3 2.25,4.064; 4 0.75,4.064; 5 -0.75,4.064; 6 -2.25,4.064; 7 -3.75,4.064; 8 -5.25,4.064 | smd 1.8 x 3.3: M1 7.85,-0.986; M2 -7.85,-0.986
MOLEX_CLICKMATE-11-VERTICAL-HEADER = smd 0.8 x 2.4: 1 7.5,4.064; 2 6,4.064; 3 4.5,4.064; 4 3,4.064; 5 1.5,4.064; 6 0,4.064; 7 -1.5,4.064; 8 -3,4.064; 9 -4.5,4.064; 10 -6,4.064; 11 -7.5,4.064 | smd 1.8 x 3.3: M1 10.1,-0.986; M2 -10.1,-0.986
MOLEX-CLIKMATE-2-VERTICAL-HEADER = smd 0.8 x 2.4: 1 0.75,4.064; 2 -0.75,4.064 | smd 1.8 x 3.3: M1 3.35,-0.986; M2 -3.35,-0.986
MOLEX-CLIKMATE-4-VERTICAL-HEADER = smd 0.8 x 2.4: 1 2.25,4.064; 2 0.75,4.064; 3 -0.75,4.064; 4 -2.25,4.064 | smd 1.8 x 3.3: M1 4.85,-0.986; M2 -4.85,-0.986
2X20 = drill 1.016 octagon: 1 -24.13,-1.27; 2 -24.13,1.27; 3 -21.59,-1.27; 4 -21.59,1.27; 5 -19.05,-1.27; 6 -19.05,1.27; 7 -16.51,-1.27; 8 -16.51,1.27; 9 -13.97,-1.27; 10 -13.97,1.27; 11 -11.43,-1.27; 12 -11.43,1.27; 13 -8.89,-1.27; 14 -8.89,1.27; 15 -6.35,-1.27; 16 -6.35,1.27; 17 -3.81,-1.27; 18 -3.81,1.27; 19 -1.27,-1.27; 20 -1.27,1.27; 21 1.27,-1.27; 22 1.27,1.27; 23 3.81,-1.27; 24 3.81,1.27; 25 6.35,-1.27; 26 6.35,1.27; 27 8.89,-1.27; 28 8.89,1.27; 29 11.43,-1.27; 30 11.43,1.27; 31 13.97,-1.27; 32 13.97,1.27; 33 16.51,-1.27; 34 16.51,1.27; 35 19.05,-1.27; 36 19.05,1.27; 37 21.59,-1.27; 38 21.59,1.27; 39 24.13,-1.27; 40 24.13,1.27
SRP6540 = smd 2.85 x 3.4: P$1 -3.275,0; P$2 3.275,0
CHIPLED_0805 = smd 1.2 x 1.2: A 0,-1.05; C 0,1.05
CHIP-LED0805 = smd 1.2 x 1.2: A 0,-1.05; C 0,1.05
ISO1541 = smd 1.9 x 0.6: 1 -2.9,1.905; 2 -2.9,0.635 | smd 1.98 x 0.6: 3 -2.9,-0.635; 4 -2.9,-1.905; 5 2.9,-1.905; 6 2.9,-0.635; 7 2.9,0.635; 8 2.9,1.905
QS = drill 0.61 long: 1 -2.54,0; 2 2.54,0
BSS138 = smd 0.8 x 1.3: D 0,1.2; G -0.95,-1.2; S 0.95,-1.2
R0805 = smd 1.1 x 1.4: 1 -1,0; 2 1,0
R0805' = smd 1.3 x 1.5: 1 -0.95,0; 2 0.95,0
B3F-10XX = drill 1.016 long: 1 -3.251,2.261; 2 3.251,2.261; 3 -3.251,-2.261; 4 3.251,-2.261
TP20R = smd 2 x 2: TP 0,0
MAX5812 = smd 1.83 x 0.56: 1 -1.45,0.95; 2 -1.45,0; 3 -1.45,-0.95; 4 1.45,-0.95; 5 1.45,0; 6 1.45,0.95
TPS562219 = smd 1.55 x 0.45: 1 -1.55,0.975; 2 -1.55,0.325; 3 -1.55,-0.325; 4 -1.55,-0.975; 5 1.55,-0.975; 6 1.55,-0.325; 7 1.55,0.325; 8 1.55,0.975
ISO734X = smd 2 x 0.6: P$1 -4.65,4.445; P$2 -4.65,3.175; P$3 -4.65,1.905; P$4 -4.65,0.635; P$5 -4.65,-0.635; P$6 -4.65,-1.905; P$7 -4.65,-3.175; P$8 -4.65,-4.445; P$9 4.65,-4.445; P$10 4.65,-3.175; P$11 4.65,-1.905; P$12 4.65,-0.635; P$13 4.65,0.635; P$14 4.65,1.905; P$15 4.65,3.175; P$16 4.65,4.445
TSSOP20_MC = smd 1.473 x 0.356: 1 -2.819,2.925; 2 -2.819,2.275; 3 -2.819,1.625; 4 -2.819,0.975; 5 -2.819,0.325; 6 -2.819,-0.325; 7 -2.819,-0.975; 8 -2.819,-1.625; 9 -2.819,-2.275; 10 -2.819,-2.925; 11 2.819,-2.925; 12 2.819,-2.275; 13 2.819,-1.625; 14 2.819,-0.975; 15 2.819,-0.325; 16 2.819,0.325; 17 2.819,0.975; 18 2.819,1.625; 19 2.819,2.275; 20 2.819,2.925
SOIC8-N_MC = smd 1.981 x 0.559: 1 -2.362,1.905; 2 -2.362,0.635; 3 -2.362,-0.635; 4 -2.362,-1.905; 5 2.362,-1.905; 6 2.362,-0.635; 7 2.362,0.635; 8 2.362,1.905
SOIC-16 = smd 0.6 x 1.55: 1 0,0; 2 1.27,0; 3 2.54,0; 4 3.81,0; 5 5.08,0; 6 6.35,0; 7 7.62,0; 8 8.89,0; 9 8.89,5.4; 10 7.62,5.4; 11 6.35,5.4; 12 5.08,5.4; 13 3.81,5.4; 14 2.54,5.4; 15 1.27,5.4; 16 0,5.4
PW16-M = smd 1.981 x 0.406: 1 -2.87,2.275; 2 -2.87,1.625; 3 -2.87,0.975; 4 -2.87,0.325; 5 -2.87,-0.325; 6 -2.87,-0.975; 7 -2.87,-1.625; 8 -2.87,-2.275; 9 2.87,-2.275; 10 2.87,-1.625; 11 2.87,-0.975; 12 2.87,-0.325; 13 2.87,0.325; 14 2.87,0.975; 15 2.87,1.625; 16 2.87,2.275
D14 = smd 1.981 x 0.559: 1 -2.464,3.81; 2 -2.464,2.54; 3 -2.464,1.27; 4 -2.464,0; 5 -2.464,-1.27; 6 -2.464,-2.54; 7 -2.464,-3.81; 8 2.464,-3.81; 9 2.464,-2.54; 10 2.464,-1.27; 11 2.464,0; 12 2.464,1.27; 13 2.464,2.54; 14 2.464,3.81
SOIC-14 = smd 0.55 x 1.5: 1 -3.81,-2.7; 2 -2.54,-2.7; 3 -1.27,-2.7; 4 0,-2.7; 5 1.27,-2.7; 6 2.54,-2.7; 7 3.81,-2.7; 8 3.81,2.7; 9 2.54,2.7; 10 1.27,2.7; 11 0,2.7; 12 -1.27,2.7; 13 -2.54,2.7; 14 -3.81,2.7
LT-SOL8 = smd 1.27 x 0.635: 1 -2.794,1.905; 2 -2.794,0.635; 3 -2.794,-0.635; 4 -2.794,-1.905; 5 2.794,-1.905; 6 2.794,-0.635; 7 2.794,0.635; 8 2.794,1.905
SON_5X6 = smd 1.27 x 0.66: 1 3.048,-1.905; 2 3.048,-0.635; 3 3.048,0.635; 4 3.048,1.905; 5 -3.048,1.905; 6 -3.048,0.635; 7 -3.048,-0.635; 8 -3.048,-1.905 | smd 4.267 x 4.47 bottom: PAD -0.33,0 | smd 4.267 x 4.47: PAD1 -0.33,0 | drill 0.381 pad 0.889: VIA1 -1.27,1.27; VIA2 0,1.27; VIA3 1.27,1.27; VIA4 -1.27,0; VIA5 0,0; VIA6 1.27,0; VIA7 -1.27,-1.27; VIA8 0,-1.27; VIA9 1.27,-1.27
D8 = smd 1.981 x 0.559: 1 -2.464,1.905; 2 -2.464,0.635; 3 -2.464,-0.635; 4 -2.464,-1.905; 5 2.464,-1.905; 6 2.464,-0.635; 7 2.464,0.635; 8 2.464,1.905

### Placement (x,y rotation side)
C1  63.5,24.13 180 top
C2  63.5,21.59 180 top
C3  63.5,19.05 180 top
C4  63.5,27.94 90 top
C5  55.88,21.59 180 top
C6  55.88,27.94 90 top
C7  58.42,27.94 90 top
C8  60.96,27.94 90 top
C9  111.76,29.21 270 top
C10  114.3,29.21 270 top
C11  116.84,29.21 270 top
C12  15.24,22.86 90 top
C13  12.7,22.86 90 top
C14  10.16,22.86 90 top
C15  19.05,22.86 0 top
C16  12.7,30.48 90 top
C17  19.05,25.4 0 top
C18  97.79,29.21 270 top
C19  19.05,27.94 0 top
C20  19.05,30.48 0 top
C21  101.6,24.13 270 top
C22  109.22,12.7 90 top
C23  111.76,12.7 90 top
C24  114.3,12.7 90 top
C25  15pF  [C0805']  113.03,50.8 90 top
C26  15pF  [C0805']  113.03,54.61 270 top
C27  0.1uF  [C0805']  111.76,43.18 90 top
C28  DNP  [C0805']  12.7,-95.25 0 top  (outside the outline)
C29  DNP  [C0805']  12.7,-110.49 0 top  (outside the outline)
C30  DNP  [C0805']  82.55,15.24 0 top
C31  59.69,46.99 90 top
C32  60.96,53.34 270 top
C39  1uF  [C0805']  58.42,53.34 90 top
C40  1uF  [C0805']  64.77,52.07 180 top
H2  5.08,50.8 270 top
H3  5.08,69.85 270 top
H4  60.96,5.08 0 top
J1  62.23,74.93 180 top
J2  50.8,74.93 180 top
J3  71.12,74.93 180 top
J4  80.01,74.93 180 top
J5  88.9,74.93 180 top
J6  43.18,5.08 0 top
JP1  91.44,31.75 90 top
L1  50.8,29.21 90 top
L2  20.32,35.56 0 top
L3  102.87,15.24 270 top
LED1  55.88,33.02 0 top
LED2  118.11,12.7 90 top
LED3  24.13,30.48 270 top
LED29  123.19,55.88 0 top
LED30  120.65,55.88 0 top
O1  29.21,50.8 180 top
Q1  116.84,52.07 270 top
Q8  71.12,48.26 90 top
Q9  85.09,22.86 90 top
Q10  15.24,-133.35 0 top  (outside the outline)
Q11  5.08,-140.97 0 top  (outside the outline)
R1  59.69,31.75 180 top
R2  63.5,33.02 270 top
R3  55.88,24.13 0 top
R4  59.69,34.29 180 top
R5  17.78,50.8 0 top
R6  17.78,45.72 0 top
R7  119.38,16.51 270 top
R8  118.11,21.59 0 top
R9  105.41,34.29 180 top
R10  116.84,16.51 270 top
R11  0  [R0805']  2.54,-95.25 0 top  (outside the outline)
R12  120.65,52.07 270 top
R13  123.19,52.07 270 top
R14  2.54,-80.01 0 top  (outside the outline)
R15  121.92,48.26 180 top
R16  123.19,45.72 180 top
R17  123.19,41.91 270 top
R18  10k  [R0805']  7.62,-95.25 0 top  (outside the outline)
R19  0  [R0805']  2.54,-110.49 0 top  (outside the outline)
R20  10k  [R0805']  7.62,-110.49 0 top  (outside the outline)
R21  0  [R0805']  77.47,15.24 180 top
R22  10k  [R0805']  77.47,17.78 180 top
R23  DNP  [R0805']  77.47,44.45 270 top
R24  22.86,26.67 90 top
R25  24.13,22.86 180 top
R26  15.24,30.48 270 top
R27  25.4,26.67 90 top
R28  DNP  [R0805']  8.89,-190.5 0 top  (outside the outline)
R29  DNP  [R0805']  15.24,-190.5 0 top  (outside the outline)
R30  10k  [R0805']  69.85,50.8 90 top
R31  10k  [R0805']  72.39,52.07 90 top
R32  100  [R0805']  54.61,52.07 180 top
R33  2.2K  [R0805']  66.04,54.61 180 top
R34  -148.59,-411.48 0 top  (outside the outline)
R35  -148.59,-417.83 0 top  (outside the outline)
R36  -148.59,-424.18 0 top  (outside the outline)
R37  -148.59,-430.53 0 top  (outside the outline)
R40  10k  [R0805']  83.82,20.32 270 top
R41  10k  [R0805']  86.36,19.05 90 top
R42  10k  [R0805']  2.54,-147.32 0 top  (outside the outline)
R43  10k  [R0805']  7.62,-147.32 0 top  (outside the outline)
R44  10k  [R0805']  12.7,-147.32 0 top  (outside the outline)
R45  10k  [R0805']  17.78,-147.32 0 top  (outside the outline)
S2  54.61,45.72 90 top
TP1  10.16,-233.68 0 top  (outside the outline)
TP2  2.54,-240.03 0 top  (outside the outline)
TP3  7.62,-240.03 0 top  (outside the outline)
TP4  140.97,69.85 0 top
TP5  10.16,-260.35 0 top  (outside the outline)
TP6  2.54,-266.7 0 top  (outside the outline)
TP7  7.62,-266.7 0 top  (outside the outline)
TP8  -87.63,-381 0 top  (outside the outline)
TP9  -87.63,-307.34 0 top  (outside the outline)
TP10  -90.17,-300.99 0 top  (outside the outline)
TP11  -97.79,-307.34 0 top  (outside the outline)
TP12  140.97,67.31 0 top
TP13  -90.17,-374.65 0 top  (outside the outline)
TP14  -97.79,-381 0 top  (outside the outline)
TP15  140.97,64.77 0 top
TP16  -90.17,-396.24 0 top  (outside the outline)
TP17  -97.79,-402.59 0 top  (outside the outline)
TP18  -92.71,-402.59 0 top  (outside the outline)
TP19  140.97,62.23 0 top
TP26  69.85,45.72 0 top
TP27  55.88,54.61 0 top
TP28  62.23,43.18 0 top
TP30  86.36,57.15 0 top
TP31  76.2,49.53 0 top
TP32  80.01,44.45 180 top
U3  17.78,48.26 180 top
U8  17.78,53.34 180 top
U9  59.69,21.59 90 top
U10  12.7,26.67 0 top
U11  29.21,73.66 180 top
U12  29.21,62.23 0 top
U13  104.14,30.48 180 top
U14  119.38,62.23 0 top
U15  116.84,43.18 0 top
U16  6.35,-105.41 0 top  (outside the outline)
U17  76.2,29.21 270 top
U18  19.05,-182.88 0 top  (outside the outline)
U19  5.08,-160.02 0 top  (outside the outline)
U20  5.08,-173.99 0 top  (outside the outline)
U21  10.16,-182.88 0 top  (outside the outline)
U22  82.55,48.26 0 top
U23  82.55,53.34 0 top
U24  5.08,-227.33 0 top  (outside the outline)
U25  6.35,-90.17 0 top  (outside the outline)
U26  3.81,-234.95 0 top  (outside the outline)
U27  5.08,-254 0 top  (outside the outline)
U28  3.81,-261.62 0 top  (outside the outline)
U29  -95.25,-294.64 0 top  (outside the outline)
U30  -96.52,-302.26 0 top  (outside the outline)
U31  -95.25,-368.3 0 top  (outside the outline)
U32  -96.52,-375.92 0 top  (outside the outline)
U33  -95.25,-389.89 0 top  (outside the outline)
U34  -96.52,-397.51 0 top  (outside the outline)
U49  64.77,48.26 0 top

### Tracks (layer width: path | path; a pad name or v marks a point on that pad's centre or on a via)
+3V3  (11 unrouted)
  Top 0.406: Q9.G 86.29,20.07 R41.2 | Q8.G 72.71,47.31 73.66,48.26 73.66,53.34 72.71,53.34 R31.2 | 72.07,53.34 R31.2 | 72.39,53.34 R31.2 | R33.1 70.8,54.61 R31.2
+3V3_CURRENT_SENSE  (2 unrouted)
  Top 0.406: C6.1 C7.1 58.42,26.67 60.96,26.67 C8.1 | 49.53,33.02 L1.P$2
+5V  (via drill 0.6)  (3 unrouted)
  Top 0.406: U11.P$16 U12.P$1 | R24.2 23.08,27.89 LED3.A | LED3.A 23.08,30.7 24.13,31.75 24.13,35.02 L2.P$2 26.29,35.56 29.65,38.93 v22.86,45.72 24.13,46.99 24.13,48.26 24.77,48.9 O1.8 | 17.78,25.4 C17.1 C19.1 C20.1 17.78,30.9 17.78,31.75 21.59,31.75 21.59,30.48 LED3.A | U3.1 21.59,47.31 v21.59,46.99 | U8.1 20,52.39 20.32,52.07 v20.32,50.8 R5.2
  Bottom 0.406: v22.86,45.72 v21.59,46.99 21.59,49.53 v20.32,50.8
+5V/1_CURRENT_SENSE  (via drill 0.6)  (8 unrouted)
  Top 0.406: U11.P$1 U12.P$16 | JP1.2 80.01,7.62 v72.39,15.24 | R7.2 119.16,15.29 LED2.A 119.38,12.48 119.38,11.43 114.72,11.43 C24.1 | 55.88,26.67 54.61,26.67 54.61,30.48 55.88,30.48 55.88,31.75 56.1,31.75 LED1.A 55.66,31.97 53.34,34.29 50.8,34.29 50.8,33.02 | U15.5 120.02,41.27 v120.65,40.64 | R16.2 v120.65,45.72 120.65,47.99 R15.2 120.92,50.8 R12.2 R13.2 124.46,49.8 v124.46,49.53 | C27.1 112.08,42.55 U15.3 | U14.20 125.34,65.16 v125.73,64.77
  Bottom 0.406: v43.18,15.24 v72.39,15.24 | v120.65,40.64 v120.65,45.72 | v124.46,49.53 125.73,50.8 125.73,57.15 127,58.42 127,59.69 125.73,60.96 125.73,63.5 v125.73,64.77
  pour Top: 100.33,11.43 115.57,11.43 115.57,8.89 100.33,8.89
AMS15V  (2 unrouted)
  Top 0.406: J6.2 43.93,10.91 45.72,12.7
AMS_15V_FILTERED  (2 unrouted)
AMS_BACK_TO_PI  (1 unrouted)
BSPD_FET_SIGNAL  (12 unrouted)
CAN_HIGH  (1 unrouted)
  Top 0.406: 122.83,42.55 R17.1 122.28,43.81 U15.7
DRIVE_DISBALE_SIGNAL_3V3  (3 unrouted)
GND  (via drill 0.6)  (14 unrouted)
  Top 0.406: U11.P$9 23.5,78.11 v22.86,77.47 | v22.86,58.42 23.5,57.78 U12.P$8 | U11.P$15 23.5,70.48 v22.86,69.85 | U12.P$2 23.5,65.41 v22.86,66.04 | R27.1 25.13,25.4 R25.1 25.4,22.86 25.4,21.59 21.59,21.59 | C20.2 C19.2 C17.2 C15.2 21.59,22.86 21.59,21.59 | U10.1 11.15,29.21 v10.16,29.21 | 21.59,21.59 16.51,21.59 16.51,22.86 15.66,23.71 C12.2 C13.2 C14.2 v8.89,25.4 | U3.2 21.59,48.26 22.86,46.99 | 22.86,46.99 21.59,45.72 R6.2 19.05,45.45 19.05,44.45 | O1.5 25.4,52.7 v24.13,53.34 26.67,54.61 | v22.86,48.26 22.86,46.99 | v21.59,50.8 21.59,52.07 20.32,53.34 U8.2 | 19.05,44.45 13.97,44.45 12.7,45.72 12.7,46.99 11.14,48.55 H2.3 H2.4 | 19.05,44.45 7.62,33.02 v7.62,31.75
  Bottom 0.406: v22.86,77.47 v22.86,69.85 v22.86,66.04 v22.86,58.42 | v8.89,25.4 8.89,27.94 v10.16,29.21 v7.62,31.75 | v24.13,53.34 22.86,53.34 22.86,50.8 | 22.86,50.8 v22.86,48.26 | 22.86,50.8 v21.59,50.8
GND1  (via drill 0.6)  (19 unrouted)
  Top 0.406: J2.2 J2.1 | U12.P$9 34.92,57.78 v35.56,58.42 | v35.56,77.47 34.92,78.11 U11.P$8 | U12.P$15 34.92,65.41 v35.56,66.04 | U11.P$2 34.92,70.48 v35.56,69.85 | C30.2 83.82,15.24 | C40.2 63.5,52.39 63.5,53.34 62.65,54.19 C32.1 60.54,54.19 59.69,53.34 | C31.1 59.91,46.35 U49.4 | C31.1 59.27,46.14 58.42,46.99 58.42,49.53 | 58.42,49.53 59.69,50.8 59.69,53.34 | S2.4 57.86,48.97 58.42,49.53 | S2.3 57.71,42.47 58.42,43.18 58.42,44.87 C31.1 | C39.2 59.69,53.34 | R10.1 117.11,17.78 R8.1 | R8.1 116.84,21.86 | R4.1 63.23,34.29 R2.1 63.5,34.29 64.77,34.29 64.77,30.48 | C6.2 C7.2 C8.2 C4.2 63.5,30.48 64.77,30.48 | U9.1 57.15,20.04 v57.15,19.05 | v60.96,17.78 61.38,17.78 C3.2 C2.2 C1.2 62.65,24.55 63.5,25.4 64.77,25.4 64.77,30.48 | 111.76,27.94 C9.2 | R8.1 v114.3,21.59 | U13.1 105.41,29.23 v105.41,27.94 | C18.2 101.18,28.36 v101.6,27.94 | C25.2 C26.2 112.71,53.34 111.76,53.34 v111.76,57.15 | U15.2 112.08,43.81 C27.2 111.76,48.26 110.49,49.53 110.49,52.07 109.22,53.34 109.22,57.15 113.03,60.96 | U14.10 115.19,59.3 v114.3,58.42
  Bottom 0.406: v35.56,58.42 v35.56,66.04 v35.56,69.85 v35.56,77.47 | v57.15,19.05 58.42,17.78 v60.96,17.78 | v101.6,27.94 v105.41,27.94 | v114.3,58.42 113.03,57.15 v111.76,57.15
  other vias: 109.22,21.59 110.49,21.59 111.76,21.59 113.03,21.59 109.22,16.51 110.49,16.51 111.76,16.51 113.03,16.51 114.3,16.51 107.95,21.59 107.95,16.51 106.68,27.94
  pour Top (rank 2): 115.57,13.97 106.68,13.97 106.68,26.67 104.14,26.67 104.14,29.21 107.95,29.21 107.95,26.67 110.49,26.67 110.49,29.21 118.11,29.21 118.11,26.67 115.57,26.67
HVR_INTERCONNECT_3V3  (2 unrouted)
  Top 0.406: Q9.S 86.68,23.81 87.63,22.86 87.63,17.78 86.68,17.78 R41.1
IMD15V  (1 unrouted)
  Top 0.406: J6.3 42.43,10.68 44.45,12.7 | R22.2 76.2,17.78 76.2,15.56 R21.2
IMD_15V_FILTERED  (1 unrouted)
  Top 0.406: U17.10 83.5,21.59 R40.1
IMD_BACK_TO_PI  (1 unrouted)
IMD_FET_SIGNAL  (1 unrouted)
  Top 0.406: R23.1 78.42,46.35 U22.4 79.76,44.45 TP32.TP
INTERUPT15V  (2 unrouted)
  Top 0.406: J6.1 45.43,11.14 46.99,12.7
INTERUPT_LINES_15V_FILTERED  (2 unrouted)
INTERUPT_LINES_BACK_TO_PI  (1 unrouted)
MCU_RESET  (via drill 0.6)
  Top 0.406: U49.2 61.59,48.9 60.96,49.53 v59.69,49.53 | v58.42,50.8 C39.1 55.88,52.39 | R33.2 63.5,54.61 62.23,55.88 57.15,55.88 TP27.TP 55.88,52.39 | 55.88,52.39 R32.1
  Bottom 0.406: v59.69,49.53 59.69,50.8 v58.42,50.8
MI  (2 unrouted)
MO  (2 unrouted)
N$1
  Top 0.406: U9.7 59.37,24.45 58.42,25.4 57.15,25.4 57.15,24.4 R3.2
N$2
  Top 0.406: LED1.C 58.47,34.07 R4.2
N$4  (1 unrouted)
N$5  (1 unrouted)
N$6  (3 unrouted)
N$7
  Top 0.406: U3.3 21.27,49.21 22.23,50.16 22.86,50.16 | O1.7 22.86,50.16 | U8.3 20.64,54.29 22.86,52.07 22.86,50.16
N$8  (via drill 0.6)  (3 unrouted)
  Top 0.406: O1.6 24.13,51.44 v24.13,52.07 | U8.4 14.29,54.29 v13.97,54.61 | U3.4 14.29,49.21 v13.97,49.53 12.7,50.8 v11.43,49.53
  Bottom 0.406: v13.97,54.61 v13.97,49.53 | v24.13,52.07 24.13,45.72 22.86,44.45 13.97,44.45 12.7,45.72 12.7,46.99 11.43,48.26 v11.43,49.53
N$9  (via drill 0.6)  (4 unrouted)
  Top 0.406: JP1.3 95.25,10.16 95.25,7.62 92.71,5.08 80.01,5.08 v72.39,12.7 | 33.02,3.81 33.02,5.08 35.56,7.62 35.56,11.43 36.83,12.7 v43.18,12.7
  Bottom 0.406: v43.18,12.7 v72.39,12.7
N$10  (via drill 0.6)  (2 unrouted)
  Top 0.406: 34.29,1.27 34.29,5.08 36.83,7.62 36.83,11.43 v40.64,11.43 | v72.39,11.43 80.01,3.81 92.71,3.81 v95.25,6.35 | v95.25,11.43 93.98,12.7 JP1.5
  Bottom 0.406: v40.64,11.43 v72.39,11.43 | v95.25,6.35 v95.25,11.43
N$11  (via drill 0.6)
  Top 0.406: R6.1 v13.97,45.72 | v13.97,48.26 U3.5
  Bottom 0.406: v13.97,45.72 v13.97,48.26
N$13  (1 unrouted)
N$17  (1 unrouted)
N$18  (via drill 0.6, 0.7)  (1 unrouted)
  Top 0.406: v87.63,8.89 87.63,10.16 JP1.6 | v72.39,13.97 80.01,6.35 v85.09,6.35
  Bottom 0.406: v33.02,2.54 33.02,5.08 35.56,7.62 35.56,11.43 36.83,12.7 41.91,12.7 43.18,13.97 v72.39,13.97 | v85.09,6.35 v87.63,8.89
N$19  (1 unrouted)
N$20  (1 unrouted)
N$21  (1 unrouted)
N$22  (1 unrouted)
N$23  (2 unrouted)
  Top 0.406: U10.7 15.56,27 16.51,27.94 16.51,29.21 15.51,29.21 R26.2
N$24  (1 unrouted)
N$25  (via drill 0.6)
  Top 0.406: U3.6 13.65,47.31 12.7,48.26 v12.7,49.53 | v11.43,55.88 9.31,55.88 H2.8
  Bottom 0.406: v12.7,49.53 12.7,55.88 v11.43,55.88
N$26
  Top 0.406: U8.6 13.65,52.39 12.7,53.34 12.7,54.61 9.2,54.61 H2.7
N$27  (1 unrouted)
N$28
  Top 0.406: LED3.C 25.4,30.26 R27.2
N$29  (1 unrouted)
N$30
  Top 0.406: U11.P$14 10.79,71.75 9.64,70.6 H3.5
N$31
  Top 0.406: U11.P$13 10.79,73.03 9.87,72.1 H3.6
N$32
  Top 0.406: U11.P$12 10.79,74.3 10.16,73.66 9.2,73.66 H3.7
N$33
  Top 0.406: U11.P$11 10.79,75.56 10.16,74.93 9.31,74.93 H3.8
N$34
  Top 0.406: U12.P$3 23.5,64.14 9.64,69.1 H3.4
N$35
  Top 0.406: U12.P$4 23.5,62.87 10.16,67.31 9.43,67.31 H3.3
N$36
  Top 0.406: U12.P$5 23.5,61.59 10.16,66.04 9.2,66.04 H3.2
N$37
  Top 0.406: U12.P$6 23.5,60.33 10.16,64.77 9.31,64.77 H3.1
N$38  (1 unrouted)
N$39  (1 unrouted)
N$40  (1 unrouted)
N$41  (1 unrouted)
N$42  (1 unrouted)
N$43  (2 unrouted)
N$44  (via drill 0.6)
  Top 0.406: 101.92,30.16 U13.7 100.66,30.16 v100.33,30.48 | v101.6,34.29 R9.2
  Bottom 0.406: v100.33,30.48 100.33,33.02 v101.6,34.29
N$45
  Top 0.406: R10.2 117.06,15.29 LED2.C
N$46  (2 unrouted)
  Top 0.406: U15.4 113.67,41.27 113.03,40.64 110.49,40.64 | 114.03,64.5 U14.2
N$47  (via drill 0.6)  (5 unrouted)
  Top 0.406: U15.1 114.48,45.54 | v113.03,64.77 113.42,65.16 U14.1
N$48  (1 unrouted)
N$49  (1 unrouted)
  Top 0.406: R15.1 123.19,48.26 124.46,49.53 124.46,59.69 123.55,60.6 U14.13
N$50  (2 unrouted)
N$51  (1 unrouted)
  Top 0.406: 122.83,41.27 R17.2 122.92,40.64 121.92,40.64 121.92,41.91 121.28,42.55 U15.6
N$52  (2 unrouted)
N$53
  Top 0.406: R21.1 C30.1 80.01,15.24 80.01,16.51 82.55,19.05 82.55,20.32 U17.9
N$54  (via drill 0.6)
  Top 0.406: v77.47,50.8 79.38,48.9 U22.2 76.83,48.9 TP31.TP | U23.4 85.6,55.37 83.82,57.15 v78.74,57.15
  Bottom 0.406: v77.47,50.8 77.47,55.88 v78.74,57.15
N$55  (2 unrouted)
N$56  (2 unrouted)
N$57  (2 unrouted)
N$58  (1 unrouted)
  Top 0.406: Q8.S 72.32,51.05 R31.1
N$59  (2 unrouted)
N$61
  Top 0.406: R30.1 69.85,48.33 Q8.D 69.85,48.26 68.58,46.99 | U49.5 67.94,46.35 68.58,46.99 | TP26.TP 68.58,46.99
N$62
  Top 0.406: R32.2 53.66,50.28 S2.2 51.64,48.26 50.8,48.26 50.8,43.18 51.51,42.47 S2.1
N$63
  pour Route2: 0,80.01 147.32,80.01 147.32,49.53 147.32,0 0,0
N$64  (2 unrouted)
N$68  (via drill 0.6)  (1 unrouted)
  Top 0.406: U14.19 124.19,64.5 124.46,64.24 v124.46,63.5 | R16.1 124.46,45.99 124.46,48.26 125.73,49.53 v125.73,59.69
  Bottom 0.406: v125.73,59.69 124.46,60.96 v124.46,63.5
N$70  (2 unrouted)
N$77
  Top 0.406: LED30.C 120.65,57.15 122.2,58.7 U14.11
N$80
  Top 0.406: LED29.C 123.19,59.69 122.92,59.95 U14.12
N$99
  Top 0.406: LED30.A R12.1
N$100
  Top 0.406: R13.1 LED29.A
N$123
  Top 0.406: Q1.1 115.89,55.56 C26.1 113.03,59.69 113.94,60.6 U14.8
N$124  (via drill 0.6)
  Top 0.406: Q1.2 113.35,49.53 C25.1 112.71,49.53 111.76,49.53 111.76,52.07 110.49,53.34 110.49,57.15 v111.76,58.42 | U14.9 114.56,59.95 v114.3,59.69
  Bottom 0.406: v114.3,59.69 113.03,59.69 v111.76,58.42
N$189
  Top 0.406: C31.2 59.91,47.62 U49.3
N$190
  Top 0.406: U49.1 62.31,51.14 C32.2
POR  (4 unrouted)
RSC_SIGNAL_3V3  (3 unrouted)
RTDS_SIGNAL  (3 unrouted)
RTDS_SOURCE  (9 unrouted)
  Top 0.406: U23.1 87,51.44 87.63,52.07 87.63,55.88 TP30.TP
RTDS_SOURCE1  (3 unrouted)
RTDS_SOURCE2  (2 unrouted)
SCK  (2 unrouted)
SS_5V
  Top 0.406: U10.5 16.21,25.7 16.51,25.4 16.51,24.13 17.78,22.86 C15.1
SS_5V1
  Top 0.406: U9.5 60.66,25.11 60.96,25.4 62.23,25.4 63.5,26.67 C4.1
SS_5V2
  Top 0.406: U13.5 102.59,32.03 101.6,33.02 99.06,33.02 97.79,31.75 C18.1
SW_5V  (via drill 0.6)  (2 unrouted)
  Top 0.406: L2.P$1 17.78,35.56 15.24,33.02 13.97,33.02 12.7,31.75 C16.2 12.28,31.75 11.43,31.75 8.89,29.21 8.89,27.94 9.84,27 U10.2 | U13.8 102.59,27.66 101.6,26.67 C21.1 | U13.2 108.28,30.16 v109.22,29.21
  other vias: 101.6,21.59 102.87,21.59 100.33,21.59 100.33,20.32 109.22,27.94
  pour Top: 107.95,26.67 110.49,26.67 110.49,30.48 107.95,30.48
  pour Top: 105.41,16.51 99.06,16.51 99.06,24.13 104.14,24.13 104.14,21.59 105.41,20.32
  pour Bottom: 110.49,30.48 110.49,22.86 105.41,22.86 104.14,21.59 105.41,20.32 105.41,16.51 99.06,16.51 99.06,24.13 107.95,24.13 107.95,30.48
SW_5V1
  Top 0.406: L1.P$1 51.34,25.4 52.07,25.4 53.34,24.13 53.34,22.86 54.61,21.59 C5.2 55.03,19.9 57.15,17.78 58.42,17.78 59.37,18.73 U9.2
VBST_5V
  Top 0.406: U10.8 14.25,28.08 C16.1
VBST_5V1
  Top 0.406: U9.8 58.28,23.14 C5.1
VCC  (via drill 0.6)  (13 unrouted)
  Top 0.406: R26.1 15.24,31.75 v16.51,33.02 | v12.7,33.02 11.43,33.02 7.62,29.21 7.62,27.94 8.26,27.3 | 8.26,27.3 9.21,26.34 U10.3 | C12.1 C13.1 C14.1 10.16,21.59 8.89,21.59 8.89,24.13 7.62,25.4 7.62,26.67 8.26,27.3 | H2.2 H2.1 8.89,45.3 8.89,38.1 v7.62,36.83
  Bottom 0.406: v16.51,33.02 v12.7,33.02 v7.62,36.83
VDD  (via drill 0.6)  (10 unrouted)
  Top 0.406: J2.4 J2.3 | R22.1 v80.01,17.78 | v82.55,17.78 83.5,17.78 R40.2 | U23.8 79.5,50.42 U22.1 | U49.7 U49.8 67.31,50.24 67.31,50.8 | C40.1 66.04,52.07 67.31,50.8 | 67.31,50.8 68.26,51.75 R30.2 | R3.1 54.61,24.13 v53.34,25.4 | C1.1 C2.1 C3.1 64.77,19.05 64.77,17.78 62.23,17.78 60.96,16.51 59.69,16.51 59.05,17.14 | v53.34,21.59 53.34,20.32 57.15,16.51 58.42,16.51 59.05,17.14 | 59.05,17.14 60.02,18.11 U9.3 | C11.1 C10.1 C9.1 111.76,31.75 107.95,31.75 | U13.3 107,30.8 107.95,31.75 | 107.95,31.75 107.95,33.02 106.68,34.29 R9.1
  Bottom 0.406: v80.01,17.78 v82.55,17.78 | v53.34,25.4 v53.34,21.59
  pour Top: 118.11,29.21 111.76,29.21 111.76,31.75 107.95,31.75 107.95,33.02 118.11,33.02
VFB_5V  (via drill 0.6)
  Top 0.406: R25.2 22.86,23.13 22.86,24.13 | 22.86,24.13 R24.1 | U10.6 16.18,26.34 v16.51,26.67 | v21.59,24.13 22.86,24.13
  Bottom 0.406: v16.51,26.67 16.51,29.21 21.59,29.21 v21.59,24.13
VFB_5V1  (via drill 0.6)
  Top 0.406: R2.2 62.23,32.02 | 62.23,32.02 60.96,32.02 R1.1 | U9.6 60.02,25.07 v59.69,25.4 | v62.23,30.48 62.23,32.02
  Bottom 0.406: v59.69,25.4 57.15,25.4 57.15,30.48 v62.23,30.48
VFB_5V2  (via drill 0.6)
  Top 0.406: 119.65,17.78 R7.1 119.11,17.78 R8.2 119.11,20.05 v118.11,19.05 | U13.6 101.28,30.8 100.33,31.75 99.06,31.75 99.06,30.48 v100.33,29.21 | v105.41,21.59 105.41,25.4 104.14,25.4 v102.87,26.67
  Bottom 0.406: v118.11,19.05 107.95,19.05 v105.41,21.59 | v102.87,26.67 100.33,26.67 v100.33,29.21